# EAGLE design Nixie Clock (EAGLE 7.2.0)

## Sheet 1 of 4
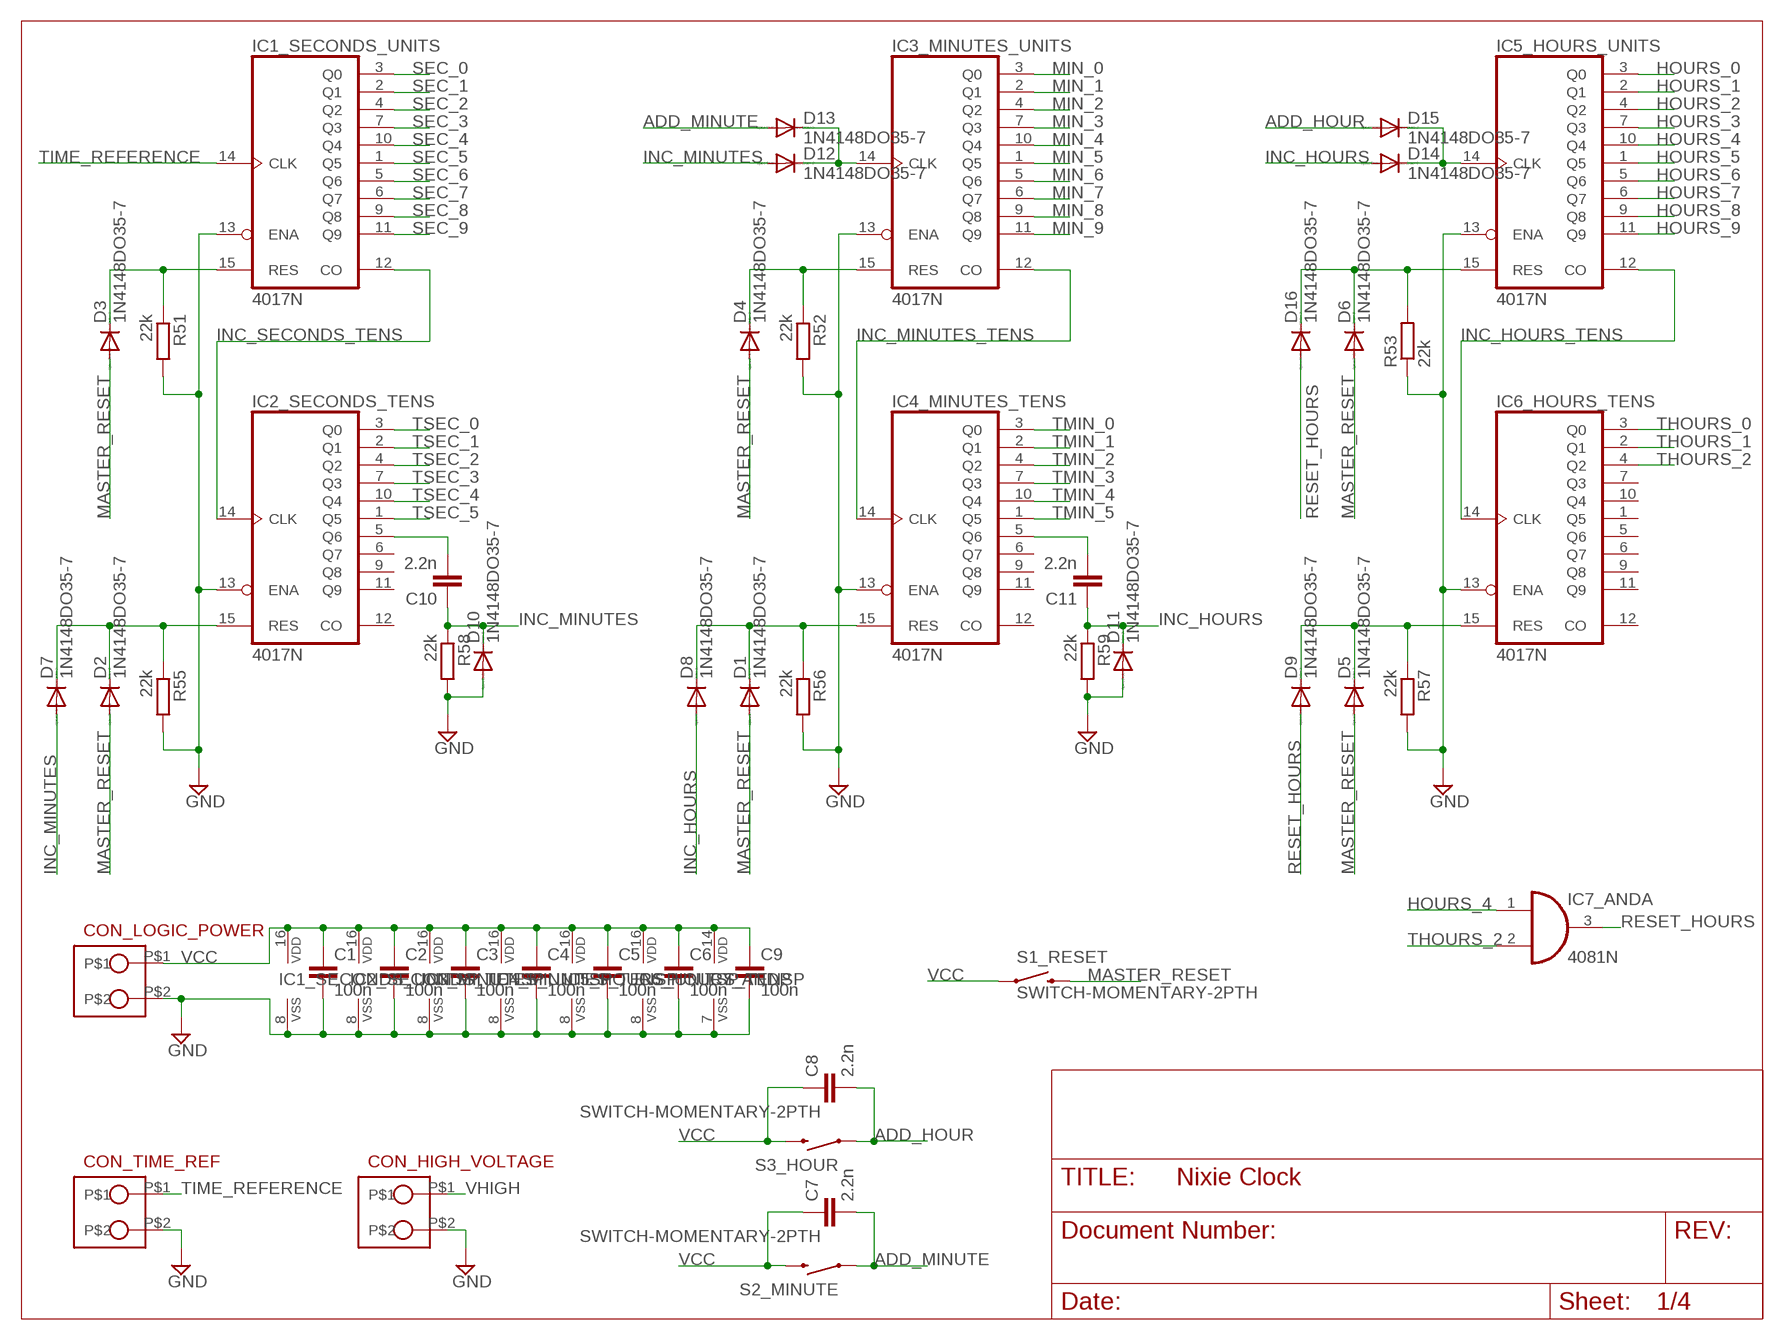
[diagram p0: schematic, sheet 1]

### Parts
C1  100n  C-EU050-030X075  [C050-030X075]
C2  100n  C-EU050-030X075  [C050-030X075]
C3  100n  C-EU050-030X075  [C050-030X075]
C4  100n  C-EU050-030X075  [C050-030X075]
C5  100n  C-EU050-030X075  [C050-030X075]
C6  100n  C-EU050-030X075  [C050-030X075]
C7  2.2n  C-EU050-030X075  [C050-030X075]
C8  2.2n  C-EU050-030X075  [C050-030X075]
C9  100n  C-EU050-030X075  [C050-030X075]
C10  2.2n  C-EU050-030X075  [C050-030X075]
C11  2.2n  C-EU050-030X075  [C050-030X075]
CON_HIGH_VOLTAGE  CON_2_SIL  [SIL_2_0.2INCH]
CON_LOGIC_POWER  CON_2_SIL  [SIL_2_0.2INCH]
CON_TIME_REF  CON_2_SIL  [SIL_2_0.2INCH]
D1  1N4148DO35-7  [DO35-7]
D2  1N4148DO35-7  [DO35-7]
D3  1N4148DO35-7  [DO35-7]
D4  1N4148DO35-7  [DO35-7]
D5  1N4148DO35-7  [DO35-7]
D6  1N4148DO35-7  [DO35-7]
D7  1N4148DO35-7  [DO35-7]
D8  1N4148DO35-7  [DO35-7]
D9  1N4148DO35-7  [DO35-7]
D10  1N4148DO35-7  [DO35-7]
D11  1N4148DO35-7  [DO35-7]
D12  1N4148DO35-7  [DO35-7]
D13  1N4148DO35-7  [DO35-7]
D14  1N4148DO35-7  [DO35-7]
D15  1N4148DO35-7  [DO35-7]
D16  1N4148DO35-7  [DO35-7]
IC1_SECONDS_UNITS  4017N  [DIL16]
IC2_SECONDS_TENS  4017N  [DIL16]
IC3_MINUTES_UNITS  4017N  [DIL16]
IC4_MINUTES_TENS  4017N  [DIL16]
IC5_HOURS_UNITS  4017N  [DIL16]
IC6_HOURS_TENS  4017N  [DIL16]
IC7_AND  4081N  [DIL14]
R51  22k  R-EU_0207/10  [0207/10]
R52  22k  R-EU_0207/10  [0207/10]
R53  22k  R-EU_0207/10  [0207/10]
R55  22k  R-EU_0207/10  [0207/10]
R56  22k  R-EU_0207/10  [0207/10]
R57  22k  R-EU_0207/10  [0207/10]
R58  22k  R-EU_0207/10  [0207/10]
R59  22k  R-EU_0207/10  [0207/10]
S1_RESET  SWITCH-MOMENTARY-2PTH  [TACTILE-PTH]
S2_MINUTE  SWITCH-MOMENTARY-2PTH  [TACTILE-PTH]
S3_HOUR  SWITCH-MOMENTARY-2PTH  [TACTILE-PTH]

### Nets
ADD_HOUR: C8.2 D15.A S3_HOUR.1
ADD_MINUTE: C7.2 D13.A S2_MINUTE.1
GND: C1.2 C2.2 C3.2 C4.2 C5.2 C6.2 C9.2 CON_HIGH_VOLTAGE.P$2 CON_LOGIC_POWER.P$2 CON_TIME_REF.P$2 D10.A D11.A IC1_SECONDS_UNITS.8(VSS) IC1_SECONDS_UNITS.13(ENA) IC2_SECONDS_TENS.8(VSS) IC2_SECONDS_TENS.13(ENA) IC3_MINUTES_UNITS.8(VSS) IC3_MINUTES_UNITS.13(ENA) IC4_MINUTES_TENS.8(VSS) IC4_MINUTES_TENS.13(ENA) IC5_HOURS_UNITS.8(VSS) IC5_HOURS_UNITS.13(ENA) IC6_HOURS_TENS.8(VSS) IC6_HOURS_TENS.13(ENA) IC7_AND.7(P:VSS) R51.2 R52.2 R53.1 R55.2 R56.2 R57.2 R58.2 R59.2 ; also sheet 2,3,4
HOURS_0: IC5_HOURS_UNITS.3(Q0) ; also sheet 4
HOURS_1: IC5_HOURS_UNITS.2(Q1) ; also sheet 4
HOURS_2: IC5_HOURS_UNITS.4(Q2) ; also sheet 4
HOURS_3: IC5_HOURS_UNITS.7(Q3) ; also sheet 4
HOURS_4: IC5_HOURS_UNITS.10(Q4) IC7_AND.1(A:I0) ; also sheet 4
HOURS_5: IC5_HOURS_UNITS.1(Q5) ; also sheet 4
HOURS_6: IC5_HOURS_UNITS.5(Q6) ; also sheet 4
HOURS_7: IC5_HOURS_UNITS.6(Q7) ; also sheet 4
HOURS_8: IC5_HOURS_UNITS.9(Q8) ; also sheet 4
HOURS_9: IC5_HOURS_UNITS.11(Q9) ; also sheet 4
INC_HOURS: C11.1 D8.A D11.C D14.A R59.1
INC_HOURS_TENS: IC5_HOURS_UNITS.12(CO) IC6_HOURS_TENS.14(CLK)
INC_MINUTES: C10.1 D7.A D10.C D12.A R58.1
INC_MINUTES_TENS: IC3_MINUTES_UNITS.12(CO) IC4_MINUTES_TENS.14(CLK)
INC_SECONDS_TENS: IC1_SECONDS_UNITS.12(CO) IC2_SECONDS_TENS.14(CLK)
MASTER_RESET: D1.A D2.A D3.A D4.A D5.A D6.A S1_RESET.3
MIN_0: IC3_MINUTES_UNITS.3(Q0) ; also sheet 3
MIN_1: IC3_MINUTES_UNITS.2(Q1) ; also sheet 3
MIN_2: IC3_MINUTES_UNITS.4(Q2) ; also sheet 3
MIN_3: IC3_MINUTES_UNITS.7(Q3) ; also sheet 3
MIN_4: IC3_MINUTES_UNITS.10(Q4) ; also sheet 3
MIN_5: IC3_MINUTES_UNITS.1(Q5) ; also sheet 3
MIN_6: IC3_MINUTES_UNITS.5(Q6) ; also sheet 3
MIN_7: IC3_MINUTES_UNITS.6(Q7) ; also sheet 3
MIN_8: IC3_MINUTES_UNITS.9(Q8) ; also sheet 3
MIN_9: IC3_MINUTES_UNITS.11(Q9) ; also sheet 3
N$80: D2.C D7.C IC2_SECONDS_TENS.15(RES) R55.1
N$89: D3.C IC1_SECONDS_UNITS.15(RES) R51.1
N$90: C10.2 IC2_SECONDS_TENS.5(Q6)
N$100: D1.C D8.C IC4_MINUTES_TENS.15(RES) R56.1
N$101: C11.2 IC4_MINUTES_TENS.5(Q6)
N$102: D4.C IC3_MINUTES_UNITS.15(RES) R52.1
N$103: D12.C D13.C IC3_MINUTES_UNITS.14(CLK)
N$104: D5.C D9.C IC6_HOURS_TENS.15(RES) R57.1
N$105: D14.C D15.C IC5_HOURS_UNITS.14(CLK)
N$109: D6.C D16.C IC5_HOURS_UNITS.15(RES) R53.2
RESET_HOURS: D9.A D16.A IC7_AND.3(A:O)
SEC_0: IC1_SECONDS_UNITS.3(Q0) ; also sheet 2
SEC_1: IC1_SECONDS_UNITS.2(Q1) ; also sheet 2
SEC_2: IC1_SECONDS_UNITS.4(Q2) ; also sheet 2
SEC_3: IC1_SECONDS_UNITS.7(Q3) ; also sheet 2
SEC_4: IC1_SECONDS_UNITS.10(Q4) ; also sheet 2
SEC_5: IC1_SECONDS_UNITS.1(Q5) ; also sheet 2
SEC_6: IC1_SECONDS_UNITS.5(Q6) ; also sheet 2
SEC_7: IC1_SECONDS_UNITS.6(Q7) ; also sheet 2
SEC_8: IC1_SECONDS_UNITS.9(Q8) ; also sheet 2
SEC_9: IC1_SECONDS_UNITS.11(Q9) ; also sheet 2
THOURS_0: IC6_HOURS_TENS.3(Q0) ; also sheet 4
THOURS_1: IC6_HOURS_TENS.2(Q1) ; also sheet 4
THOURS_2: IC6_HOURS_TENS.4(Q2) IC7_AND.2(A:I1) ; also sheet 4
TIME_REFERENCE: CON_TIME_REF.P$1 IC1_SECONDS_UNITS.14(CLK)
TMIN_0: IC4_MINUTES_TENS.3(Q0) ; also sheet 3
TMIN_1: IC4_MINUTES_TENS.2(Q1) ; also sheet 3
TMIN_2: IC4_MINUTES_TENS.4(Q2) ; also sheet 3
TMIN_3: IC4_MINUTES_TENS.7(Q3) ; also sheet 3
TMIN_4: IC4_MINUTES_TENS.10(Q4) ; also sheet 3
TMIN_5: IC4_MINUTES_TENS.1(Q5) ; also sheet 3
TSEC_0: IC2_SECONDS_TENS.3(Q0) ; also sheet 2
TSEC_1: IC2_SECONDS_TENS.2(Q1) ; also sheet 2
TSEC_2: IC2_SECONDS_TENS.4(Q2) ; also sheet 2
TSEC_3: IC2_SECONDS_TENS.7(Q3) ; also sheet 2
TSEC_4: IC2_SECONDS_TENS.10(Q4) ; also sheet 2
TSEC_5: IC2_SECONDS_TENS.1(Q5) ; also sheet 2
VCC: C1.1 C2.1 C3.1 C4.1 C5.1 C6.1 C7.1 C8.1 C9.1 CON_LOGIC_POWER.P$1 IC1_SECONDS_UNITS.16(VDD) IC2_SECONDS_TENS.16(VDD) IC3_MINUTES_UNITS.16(VDD) IC4_MINUTES_TENS.16(VDD) IC5_HOURS_UNITS.16(VDD) IC6_HOURS_TENS.16(VDD) IC7_AND.14(P:VDD) S1_RESET.1 S2_MINUTE.3 S3_HOUR.3
VHIGH: CON_HIGH_VOLTAGE.P$1 ; also sheet 2,3,4
Unconnected: IC2_SECONDS_TENS.6(Q7) IC2_SECONDS_TENS.9(Q8) IC2_SECONDS_TENS.11(Q9) IC2_SECONDS_TENS.12(CO) IC4_MINUTES_TENS.6(Q7) IC4_MINUTES_TENS.9(Q8) IC4_MINUTES_TENS.11(Q9) IC4_MINUTES_TENS.12(CO) IC6_HOURS_TENS.1(Q5) IC6_HOURS_TENS.5(Q6) IC6_HOURS_TENS.6(Q7) IC6_HOURS_TENS.7(Q3) IC6_HOURS_TENS.9(Q8) IC6_HOURS_TENS.10(Q4) IC6_HOURS_TENS.11(Q9) IC6_HOURS_TENS.12(CO) IC7_AND.4(B:O) IC7_AND.5(B:I0) IC7_AND.6(B:I1) IC7_AND.8(C:I0) IC7_AND.9(C:I1) IC7_AND.10(C:O) IC7_AND.11(D:O) IC7_AND.12(D:I0) IC7_AND.13(D:I1)

## Sheet 2 of 4
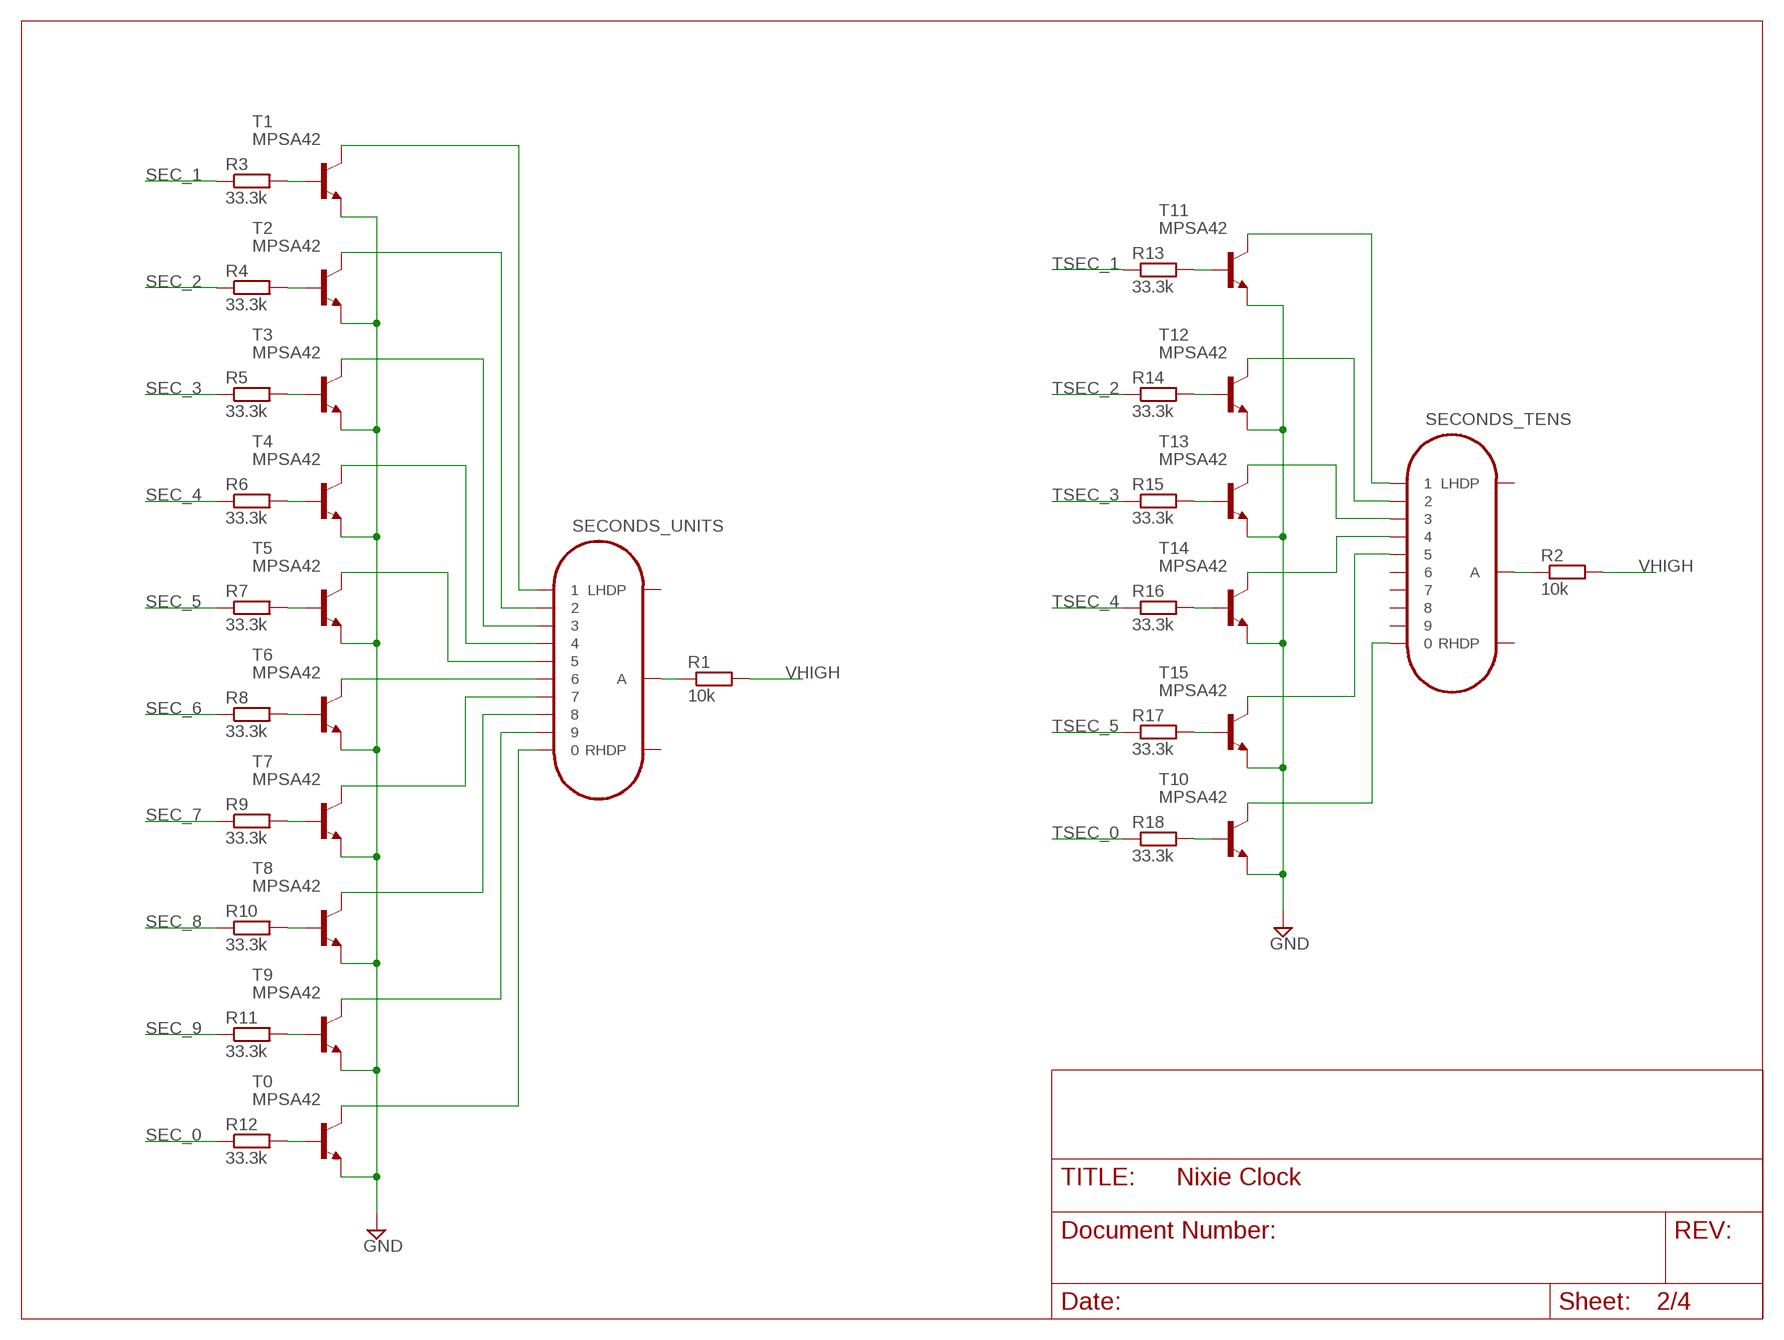
[diagram p1: schematic, sheet 2]

### Parts
R1  10k  R-EU_0207/2V  [0207/2V]
R2  10k  R-EU_0207/2V  [0207/2V]
R3  33.3k  R-EU_0207/10  [0207/10]
R4  33.3k  R-EU_0207/10  [0207/10]
R5  33.3k  R-EU_0207/10  [0207/10]
R6  33.3k  R-EU_0207/10  [0207/10]
R7  33.3k  R-EU_0207/10  [0207/10]
R8  33.3k  R-EU_0207/10  [0207/10]
R9  33.3k  R-EU_0207/10  [0207/10]
R10  33.3k  R-EU_0207/10  [0207/10]
R11  33.3k  R-EU_0207/10  [0207/10]
R12  33.3k  R-EU_0207/10  [0207/10]
R13  33.3k  R-EU_0207/10  [0207/10]
R14  33.3k  R-EU_0207/10  [0207/10]
R15  33.3k  R-EU_0207/10  [0207/10]
R16  33.3k  R-EU_0207/10  [0207/10]
R17  33.3k  R-EU_0207/10  [0207/10]
R18  33.3k  R-EU_0207/10  [0207/10]
SECONDS_TENS  IN-14BIG_PADS  [IN-14-BIG-PADS]
SECONDS_UNITS  IN-14BIG_PADS  [IN-14-BIG-PADS]
T0  MPSA42  [TO92]
T1  MPSA42  [TO92]
T2  MPSA42  [TO92]
T3  MPSA42  [TO92]
T4  MPSA42  [TO92]
T5  MPSA42  [TO92]
T6  MPSA42  [TO92]
T7  MPSA42  [TO92]
T8  MPSA42  [TO92]
T9  MPSA42  [TO92]
T10  MPSA42  [TO92]
T11  MPSA42  [TO92]
T12  MPSA42  [TO92]
T13  MPSA42  [TO92]
T14  MPSA42  [TO92]
T15  MPSA42  [TO92]

### Nets
GND: T0.1(E) T1.1(E) T2.1(E) T3.1(E) T4.1(E) T5.1(E) T6.1(E) T7.1(E) T8.1(E) T9.1(E) T10.1(E) T11.1(E) T12.1(E) T13.1(E) T14.1(E) T15.1(E) ; also sheet 1,3,4
N$1: R6.2 T4.2(B)
N$2: R7.2 T5.2(B)
N$3: R8.2 T6.2(B)
N$4: R9.2 T7.2(B)
N$5: R10.2 T8.2(B)
N$6: R11.2 T9.2(B)
N$7: R12.2 T0.2(B)
N$8: R1.1 SECONDS_UNITS.A
N$9: R2.1 SECONDS_TENS.A
N$10: R13.2 T11.2(B)
N$11: R14.2 T12.2(B)
N$12: R15.2 T13.2(B)
N$13: R16.2 T14.2(B)
N$14: R17.2 T15.2(B)
N$15: R18.2 T10.2(B)
N$16: R3.2 T1.2(B)
N$17: R4.2 T2.2(B)
N$18: R5.2 T3.2(B)
N$19: SECONDS_TENS.1 T11.3(C)
N$20: SECONDS_TENS.2 T12.3(C)
N$21: SECONDS_TENS.3 T13.3(C)
N$22: SECONDS_TENS.4 T14.3(C)
N$23: SECONDS_TENS.5 T15.3(C)
N$24: SECONDS_TENS.0 T10.3(C)
N$26: SECONDS_UNITS.1 T1.3(C)
N$27: SECONDS_UNITS.2 T2.3(C)
N$28: SECONDS_UNITS.3 T3.3(C)
N$29: SECONDS_UNITS.4 T4.3(C)
N$30: SECONDS_UNITS.5 T5.3(C)
N$31: SECONDS_UNITS.6 T6.3(C)
N$32: SECONDS_UNITS.0 T0.3(C)
N$33: SECONDS_UNITS.9 T9.3(C)
N$34: SECONDS_UNITS.8 T8.3(C)
N$79: SECONDS_UNITS.7 T7.3(C)
SEC_0: R12.1 ; also sheet 1
SEC_1: R3.1 ; also sheet 1
SEC_2: R4.1 ; also sheet 1
SEC_3: R5.1 ; also sheet 1
SEC_4: R6.1 ; also sheet 1
SEC_5: R7.1 ; also sheet 1
SEC_6: R8.1 ; also sheet 1
SEC_7: R9.1 ; also sheet 1
SEC_8: R10.1 ; also sheet 1
SEC_9: R11.1 ; also sheet 1
TSEC_0: R18.1 ; also sheet 1
TSEC_1: R13.1 ; also sheet 1
TSEC_2: R14.1 ; also sheet 1
TSEC_3: R15.1 ; also sheet 1
TSEC_4: R16.1 ; also sheet 1
TSEC_5: R17.1 ; also sheet 1
VHIGH: R1.2 R2.2 ; also sheet 1,3,4
Unconnected: SECONDS_TENS.6 SECONDS_TENS.7 SECONDS_TENS.8 SECONDS_TENS.9 SECONDS_TENS.LHDP SECONDS_TENS.RHDP SECONDS_UNITS.LHDP SECONDS_UNITS.RHDP

## Sheet 3 of 4
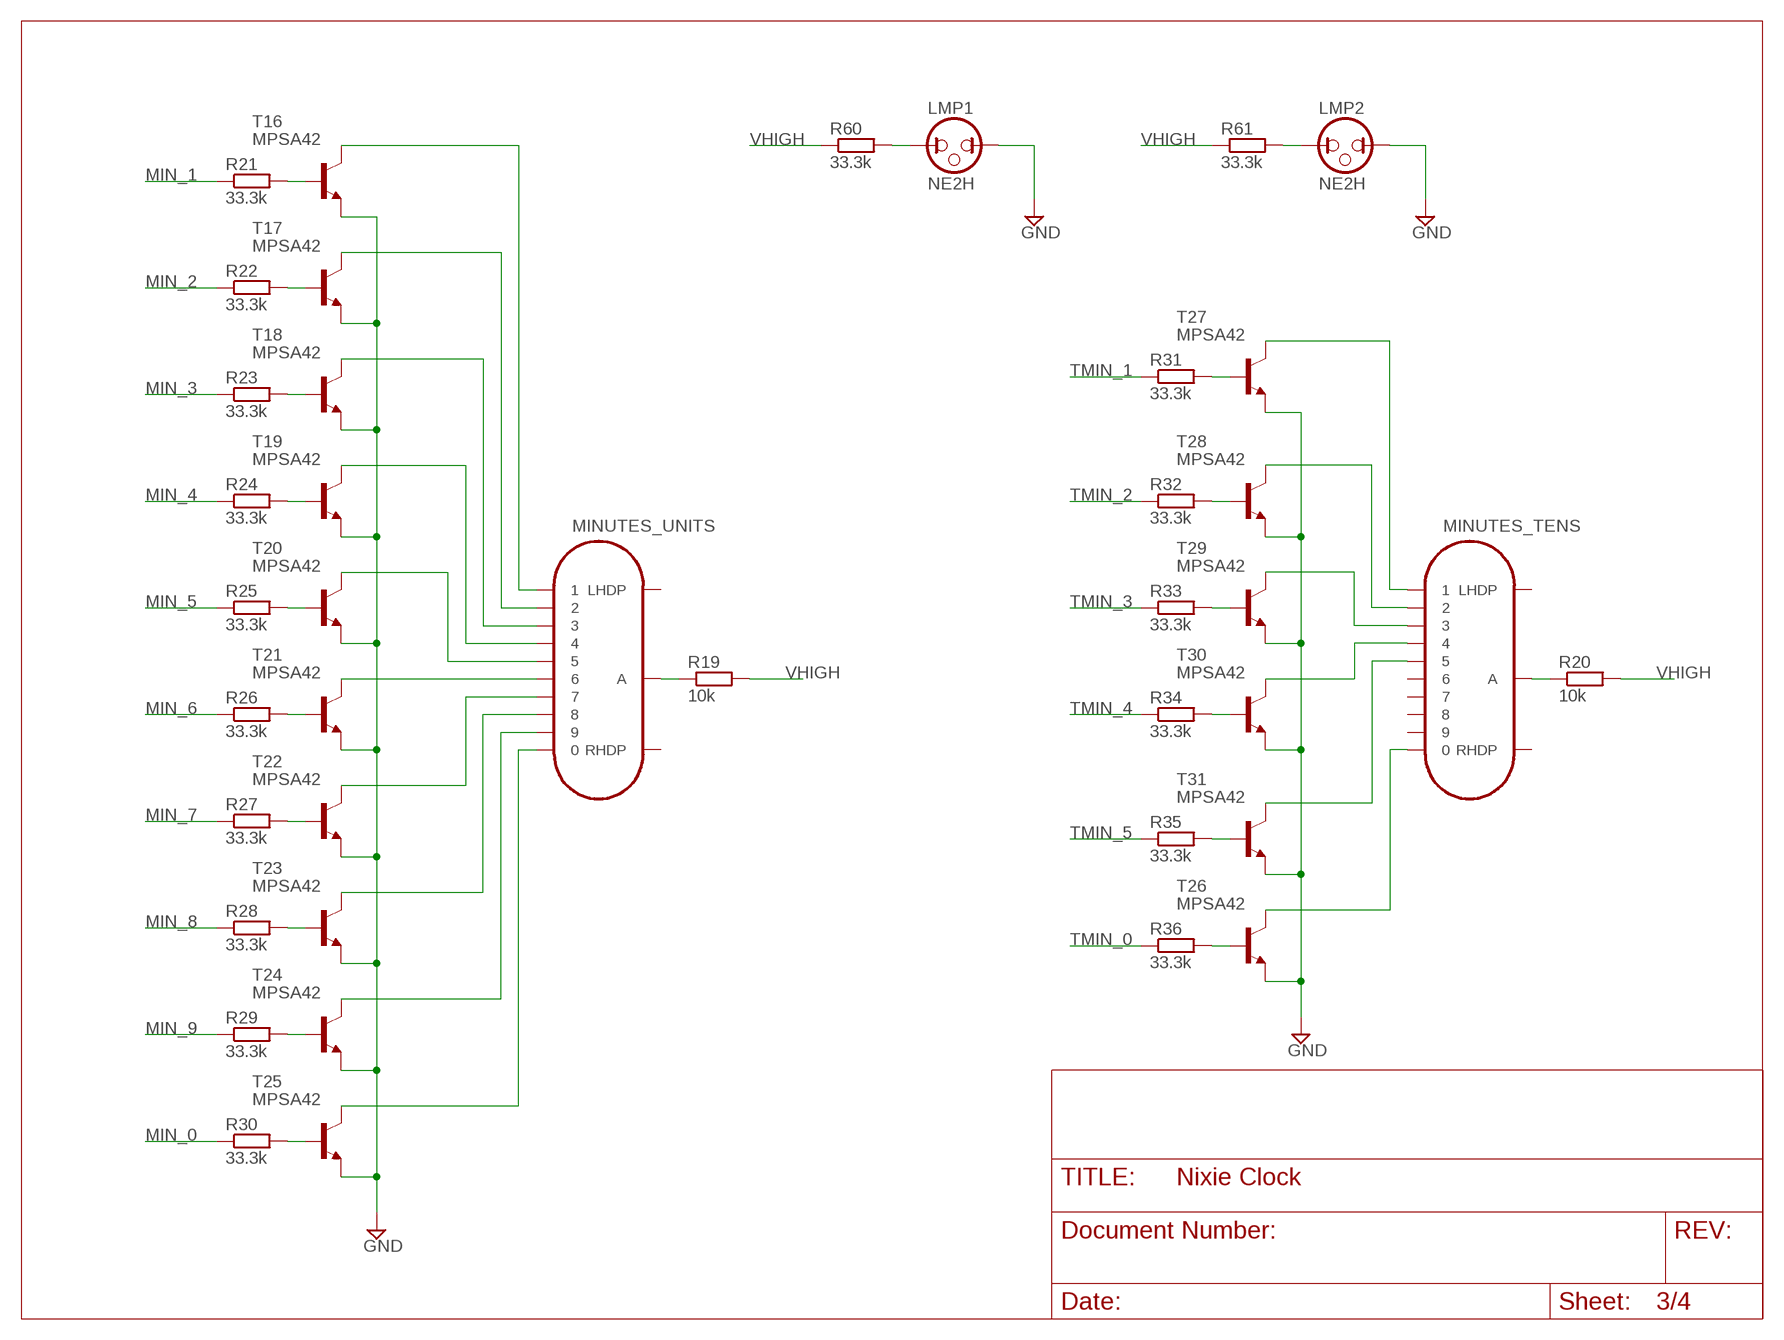
[diagram p2: schematic, sheet 3]

### Parts
LMP1  NE2H  NEON_LAMP  [NEON_LAMP_0.1_INCH]
LMP2  NE2H  NEON_LAMP  [NEON_LAMP_0.1_INCH]
MINUTES_TENS  IN-14BIG_PADS  [IN-14-BIG-PADS]
MINUTES_UNITS  IN-14BIG_PADS  [IN-14-BIG-PADS]
R19  10k  R-EU_0207/2V  [0207/2V]
R20  10k  R-EU_0207/2V  [0207/2V]
R21  33.3k  R-EU_0207/10  [0207/10]
R22  33.3k  R-EU_0207/10  [0207/10]
R23  33.3k  R-EU_0207/10  [0207/10]
R24  33.3k  R-EU_0207/10  [0207/10]
R25  33.3k  R-EU_0207/10  [0207/10]
R26  33.3k  R-EU_0207/10  [0207/10]
R27  33.3k  R-EU_0207/10  [0207/10]
R28  33.3k  R-EU_0207/10  [0207/10]
R29  33.3k  R-EU_0207/10  [0207/10]
R30  33.3k  R-EU_0207/10  [0207/10]
R31  33.3k  R-EU_0207/10  [0207/10]
R32  33.3k  R-EU_0207/10  [0207/10]
R33  33.3k  R-EU_0207/10  [0207/10]
R34  33.3k  R-EU_0207/10  [0207/10]
R35  33.3k  R-EU_0207/10  [0207/10]
R36  33.3k  R-EU_0207/10  [0207/10]
R60  33.3k  R-EU_0207/2V  [0207/2V]
R61  33.3k  R-EU_0207/2V  [0207/2V]
T16  MPSA42  [TO92]
T17  MPSA42  [TO92]
T18  MPSA42  [TO92]
T19  MPSA42  [TO92]
T20  MPSA42  [TO92]
T21  MPSA42  [TO92]
T22  MPSA42  [TO92]
T23  MPSA42  [TO92]
T24  MPSA42  [TO92]
T25  MPSA42  [TO92]
T26  MPSA42  [TO92]
T27  MPSA42  [TO92]
T28  MPSA42  [TO92]
T29  MPSA42  [TO92]
T30  MPSA42  [TO92]
T31  MPSA42  [TO92]

### Nets
GND: LMP1.P$2 LMP2.P$2 T16.1(E) T17.1(E) T18.1(E) T19.1(E) T20.1(E) T21.1(E) T22.1(E) T23.1(E) T24.1(E) T25.1(E) T26.1(E) T27.1(E) T28.1(E) T29.1(E) T30.1(E) T31.1(E) ; also sheet 1,2,4
MIN_0: R30.1 ; also sheet 1
MIN_1: R21.1 ; also sheet 1
MIN_2: R22.1 ; also sheet 1
MIN_3: R23.1 ; also sheet 1
MIN_4: R24.1 ; also sheet 1
MIN_5: R25.1 ; also sheet 1
MIN_6: R26.1 ; also sheet 1
MIN_7: R27.1 ; also sheet 1
MIN_8: R28.1 ; also sheet 1
MIN_9: R29.1 ; also sheet 1
N$35: R24.2 T19.2(B)
N$36: R25.2 T20.2(B)
N$37: R26.2 T21.2(B)
N$38: R27.2 T22.2(B)
N$39: R28.2 T23.2(B)
N$40: R29.2 T24.2(B)
N$41: R30.2 T25.2(B)
N$42: MINUTES_UNITS.A R19.1
N$43: MINUTES_TENS.A R20.1
N$44: R31.2 T27.2(B)
N$45: R32.2 T28.2(B)
N$46: R33.2 T29.2(B)
N$47: R34.2 T30.2(B)
N$48: R35.2 T31.2(B)
N$49: R36.2 T26.2(B)
N$50: R21.2 T16.2(B)
N$51: R22.2 T17.2(B)
N$52: R23.2 T18.2(B)
N$53: MINUTES_TENS.1 T27.3(C)
N$54: MINUTES_TENS.2 T28.3(C)
N$55: MINUTES_TENS.3 T29.3(C)
N$56: MINUTES_TENS.4 T30.3(C)
N$57: MINUTES_TENS.5 T31.3(C)
N$58: MINUTES_TENS.0 T26.3(C)
N$59: MINUTES_UNITS.1 T16.3(C)
N$60: MINUTES_UNITS.2 T17.3(C)
N$61: MINUTES_UNITS.3 T18.3(C)
N$62: MINUTES_UNITS.4 T19.3(C)
N$63: MINUTES_UNITS.5 T20.3(C)
N$64: MINUTES_UNITS.6 T21.3(C)
N$65: MINUTES_UNITS.0 T25.3(C)
N$66: MINUTES_UNITS.9 T24.3(C)
N$67: MINUTES_UNITS.8 T23.3(C)
N$87: MINUTES_UNITS.7 T22.3(C)
N$107: LMP2.P$1 R61.2
N$108: LMP1.P$1 R60.2
TMIN_0: R36.1 ; also sheet 1
TMIN_1: R31.1 ; also sheet 1
TMIN_2: R32.1 ; also sheet 1
TMIN_3: R33.1 ; also sheet 1
TMIN_4: R34.1 ; also sheet 1
TMIN_5: R35.1 ; also sheet 1
VHIGH: R19.2 R20.2 R60.1 R61.1 ; also sheet 1,2,4
Unconnected: MINUTES_TENS.6 MINUTES_TENS.7 MINUTES_TENS.8 MINUTES_TENS.9 MINUTES_TENS.LHDP MINUTES_TENS.RHDP MINUTES_UNITS.LHDP MINUTES_UNITS.RHDP

## Sheet 4 of 4
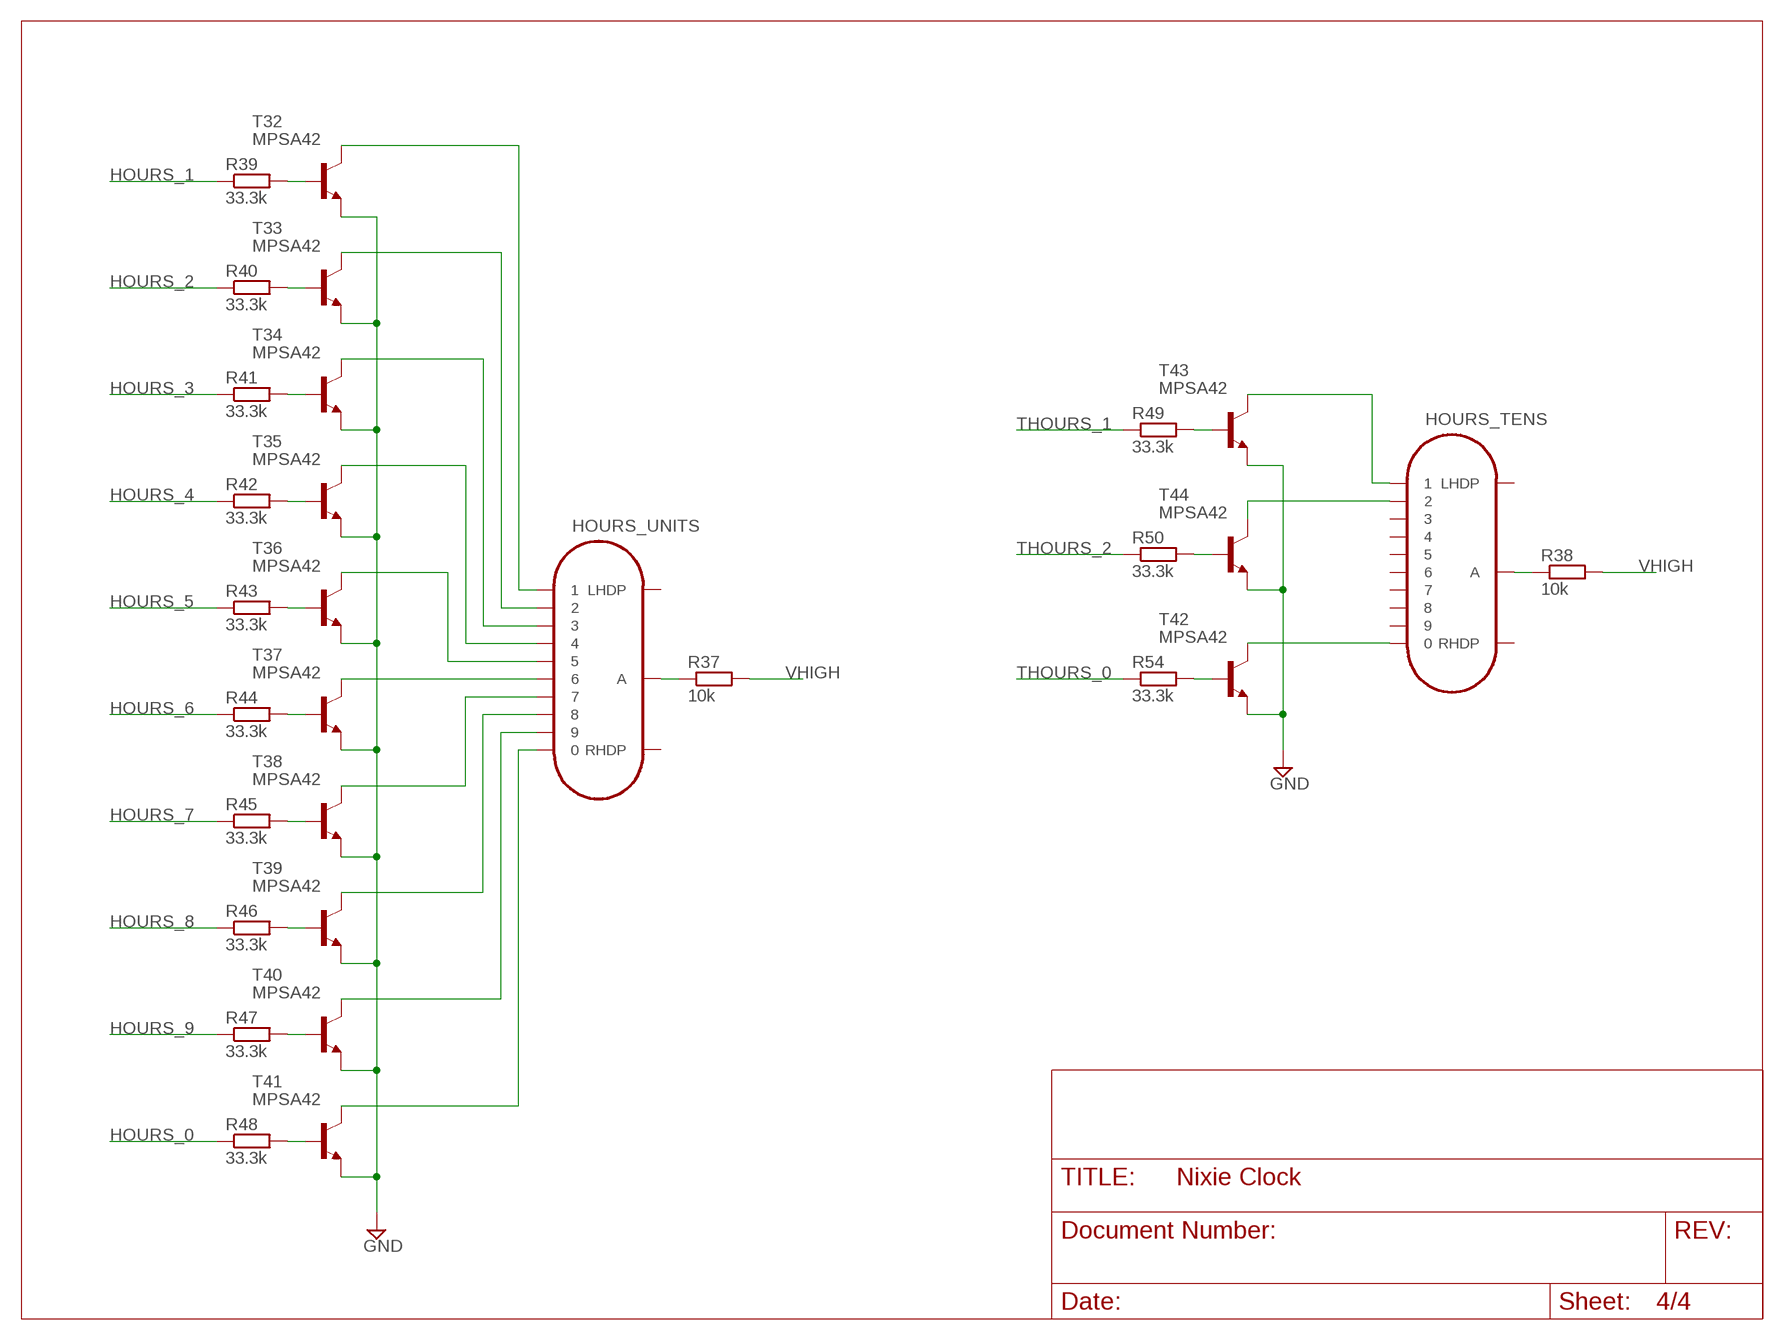
[diagram p3: schematic, sheet 4]

### Parts
HOURS_TENS  IN-14BIG_PADS  [IN-14-BIG-PADS]
HOURS_UNITS  IN-14BIG_PADS  [IN-14-BIG-PADS]
R37  10k  R-EU_0207/2V  [0207/2V]
R38  10k  R-EU_0207/2V  [0207/2V]
R39  33.3k  R-EU_0207/10  [0207/10]
R40  33.3k  R-EU_0207/10  [0207/10]
R41  33.3k  R-EU_0207/10  [0207/10]
R42  33.3k  R-EU_0207/10  [0207/10]
R43  33.3k  R-EU_0207/10  [0207/10]
R44  33.3k  R-EU_0207/10  [0207/10]
R45  33.3k  R-EU_0207/10  [0207/10]
R46  33.3k  R-EU_0207/10  [0207/10]
R47  33.3k  R-EU_0207/10  [0207/10]
R48  33.3k  R-EU_0207/10  [0207/10]
R49  33.3k  R-EU_0207/10  [0207/10]
R50  33.3k  R-EU_0207/10  [0207/10]
R54  33.3k  R-EU_0207/10  [0207/10]
T32  MPSA42  [TO92]
T33  MPSA42  [TO92]
T34  MPSA42  [TO92]
T35  MPSA42  [TO92]
T36  MPSA42  [TO92]
T37  MPSA42  [TO92]
T38  MPSA42  [TO92]
T39  MPSA42  [TO92]
T40  MPSA42  [TO92]
T41  MPSA42  [TO92]
T42  MPSA42  [TO92]
T43  MPSA42  [TO92]
T44  MPSA42  [TO92]

### Nets
GND: T32.1(E) T33.1(E) T34.1(E) T35.1(E) T36.1(E) T37.1(E) T38.1(E) T39.1(E) T40.1(E) T41.1(E) T42.1(E) T43.1(E) T44.1(E) ; also sheet 1,2,3
HOURS_0: R48.1 ; also sheet 1
HOURS_1: R39.1 ; also sheet 1
HOURS_2: R40.1 ; also sheet 1
HOURS_3: R41.1 ; also sheet 1
HOURS_4: R42.1 ; also sheet 1
HOURS_5: R43.1 ; also sheet 1
HOURS_6: R44.1 ; also sheet 1
HOURS_7: R45.1 ; also sheet 1
HOURS_8: R46.1 ; also sheet 1
HOURS_9: R47.1 ; also sheet 1
N$25: R42.2 T35.2(B)
N$68: R43.2 T36.2(B)
N$69: R44.2 T37.2(B)
N$70: R45.2 T38.2(B)
N$71: R46.2 T39.2(B)
N$72: R47.2 T40.2(B)
N$73: R48.2 T41.2(B)
N$74: HOURS_UNITS.A R37.1
N$75: HOURS_TENS.A R38.1
N$76: R49.2 T43.2(B)
N$77: R50.2 T44.2(B)
N$78: HOURS_TENS.0 T42.3(C)
N$81: R54.2 T42.2(B)
N$82: R39.2 T32.2(B)
N$83: R40.2 T33.2(B)
N$84: R41.2 T34.2(B)
N$85: HOURS_TENS.1 T43.3(C)
N$86: HOURS_TENS.2 T44.3(C)
N$88: HOURS_UNITS.7 T38.3(C)
N$91: HOURS_UNITS.1 T32.3(C)
N$92: HOURS_UNITS.2 T33.3(C)
N$93: HOURS_UNITS.3 T34.3(C)
N$94: HOURS_UNITS.4 T35.3(C)
N$95: HOURS_UNITS.5 T36.3(C)
N$96: HOURS_UNITS.6 T37.3(C)
N$97: HOURS_UNITS.0 T41.3(C)
N$98: HOURS_UNITS.9 T40.3(C)
N$99: HOURS_UNITS.8 T39.3(C)
THOURS_0: R54.1 ; also sheet 1
THOURS_1: R49.1 ; also sheet 1
THOURS_2: R50.1 ; also sheet 1
VHIGH: R37.2 R38.2 ; also sheet 1,2,3
Unconnected: HOURS_TENS.3 HOURS_TENS.4 HOURS_TENS.5 HOURS_TENS.6 HOURS_TENS.7 HOURS_TENS.8 HOURS_TENS.9 HOURS_TENS.LHDP HOURS_TENS.RHDP HOURS_UNITS.LHDP HOURS_UNITS.RHDP

## Library data of the parts
C1-C11 = resistor:C-EU: CAPACITOR, European symbol
CON_HIGH_VOLTAGE CON_LOGIC_POWER CON_TIME_REF = PGT:CON_2_SIL: Connecteur à 2 pattes, avec un écart de 0.2 inc (soit 5.08 mm).
D1-D16 = diode:1N4148: DIODE high speed (Philips)
HOURS_TENS HOURS_UNITS MINUTES_TENS MINUTES_UNITS SECONDS_TENS SECONDS_UNITS = PGT:IN-14: IN-14: medium numeric frontview nixie tube
IC1_SECONDS_UNITS IC2_SECONDS_TENS IC3_MINUTES_UNITS IC4_MINUTES_TENS IC5_HOURS_UNITS IC6_HOURS_TENS = 40xx:4017: COUNTER/DIVIDER
IC7_AND = 40xx:4081: Quad 2-input AND
LMP1 LMP2 = PGT:NEON_LAMP: Neon lamp.
R1-R61 = resistor:R-EU_: RESISTOR, European symbol
S1_RESET S2_MINUTE S3_HOUR = SparkFun-Electromechanical:SWITCH-MOMENTARY-2: Various NO switches- pushbuttons, reed, etc; PROD_ID: SWCH-08441
T0 T1-T44 = PGT:MPSA42: NPN TRANSISTOR

## Board
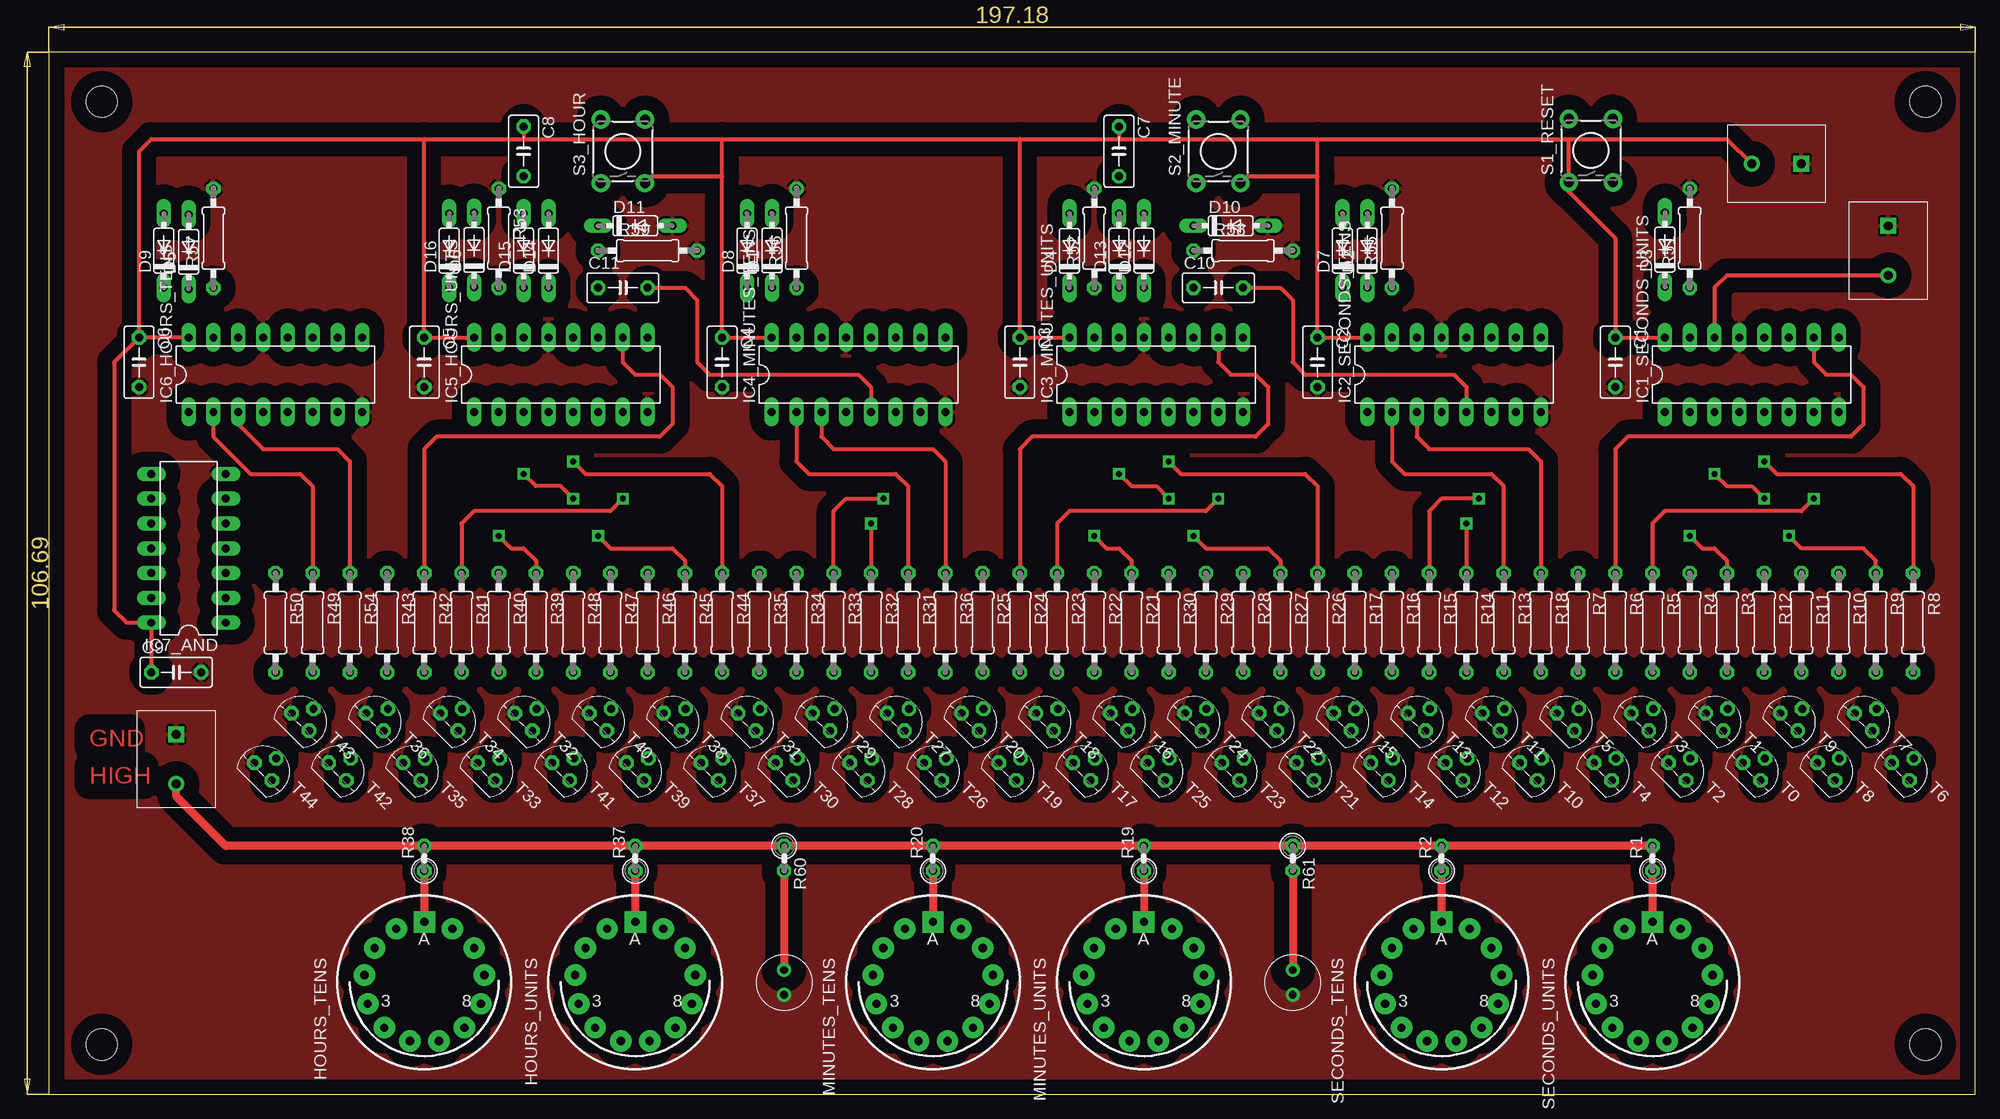
[diagram p4: board, top side]
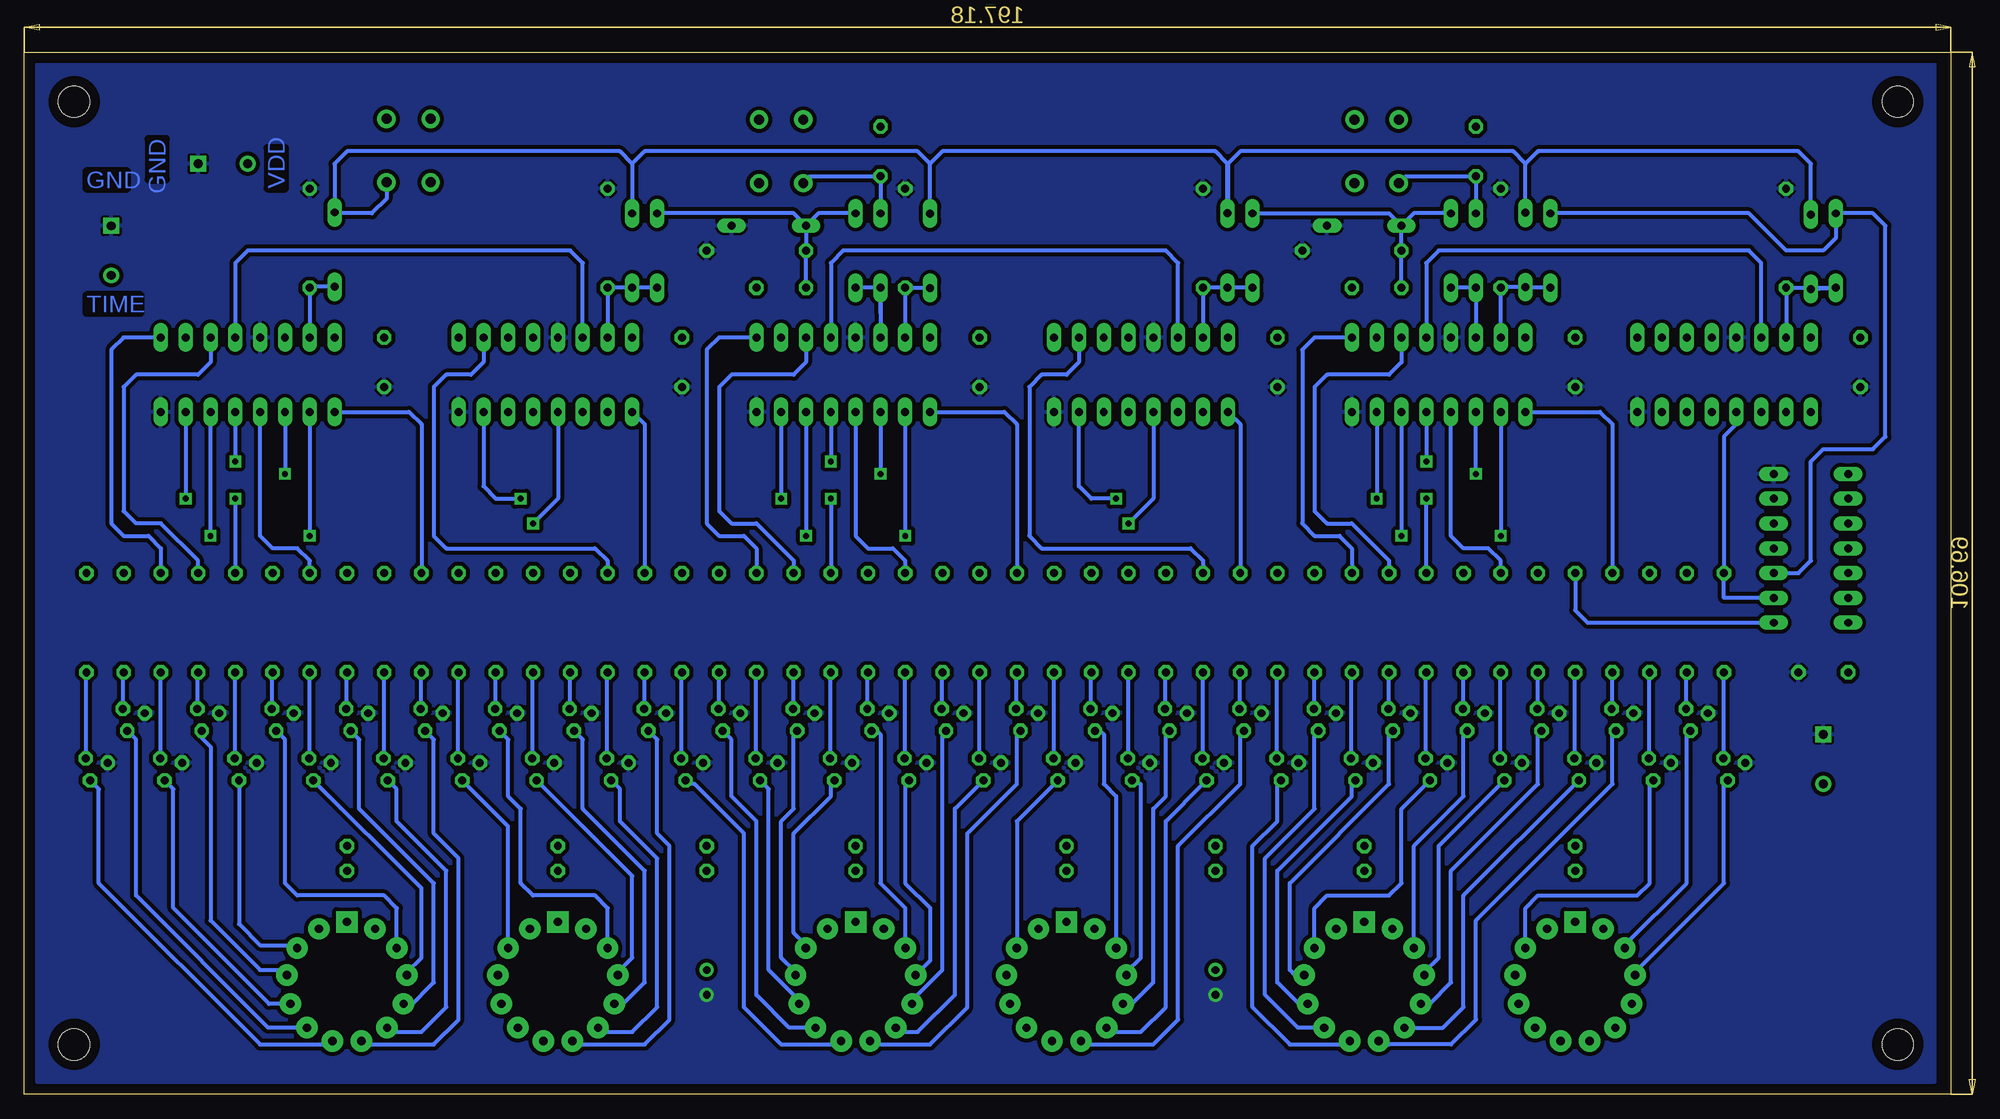
[diagram p5: board, bottom side, seen from below]

Size 197.18 x 106.69 mm. Coordinates in mm from the lower left corner, seen from the top.
Outline: 197.18,106.69 0,106.69 0,0 197.18,0 197.18,106.69
Copper layers (1*16): Top 0.035mm / dielectric 1.5mm / Bottom 0.035mm
Design rules "default *": minimum track width 10mil, minimum drill 24mil, track to track 8mil, track to pad 8mil, pad to pad 8mil, via to via 8mil, smd to smd 8mil, copper to edge 40mil, drill to drill 8mil, minimum pad ring 10mil, minimum via ring 8mil, stop-mask expansion 4mil, vias tented up to drill 0mil, thermal gap 10mil
Holes 3.2 mm at 5.41,101.61 192.1,101.61 192.1,5.09 5.41,5.09

### Footprints (pad centres in the part's own frame; a part is rotated, then mirrored left to right if it is on the bottom)
C050-030X075 = drill 0.813 octagon: 1 -2.54,0; 2 2.54,0
SIL_2_0.2INCH = drill 0.9: P$1 0,2.54 | drill 0.9 square: P$2 0,-2.54
DO35-7 = drill 0.813 long: A 3.81,0; C -3.81,0
IN-14-BIG-PADS = drill 0.84 pad 2.184: 0 5.094,3.516; 1 -5.094,3.516; 2 -6.145,0.746; 3 -5.788,-2.195; 4 -4.105,-4.633; 5 -1.481,-6.01; 6 1.481,-6.01; 7 4.105,-4.633; 8 5.788,-2.195; 9 6.145,0.746; LHDP -2.877,5.481; RHDP 2.877,5.481 | drill 0.84 pad 2.184 square: A 0,6.19
DIL16 = drill 0.813 long: 1 -8.89,-3.81; 2 -6.35,-3.81; 3 -3.81,-3.81; 4 -1.27,-3.81; 5 1.27,-3.81; 6 3.81,-3.81; 7 6.35,-3.81; 8 8.89,-3.81; 9 8.89,3.81; 10 6.35,3.81; 11 3.81,3.81; 12 1.27,3.81; 13 -1.27,3.81; 14 -3.81,3.81; 15 -6.35,3.81; 16 -8.89,3.81
DIL14 = drill 0.813 long: 1 -7.62,-3.81; 2 -5.08,-3.81; 3 -2.54,-3.81; 4 0,-3.81; 5 2.54,-3.81; 6 5.08,-3.81; 7 7.62,-3.81; 8 7.62,3.81; 9 5.08,3.81; 10 2.54,3.81; 11 0,3.81; 12 -2.54,3.81; 13 -5.08,3.81; 14 -7.62,3.81
NEON_LAMP_0.1_INCH = drill 0.8: P$1 -1.27,0; P$2 1.27,0
0207/2V = drill 0.813 octagon: 1 -1.27,0; 2 1.27,0
0207/10 = drill 0.813 octagon: 1 -5.08,0; 2 5.08,0
TACTILE-PTH = drill 1.016 pad 1.88: 1 -3.251,2.261; 2 3.251,2.261; 3 -3.251,-2.261; 4 3.251,-2.261
TO92 = drill 0.813 octagon: 1 -1.27,0; 2 0,1.905; 3 1.27,0

### Placement (x,y rotation side)
C1  160.35,74.94 270 top
C2  129.87,74.94 270 top
C3  99.39,74.94 270 top
C4  68.91,74.94 270 top
C5  38.43,74.94 270 top
C6  9.22,74.94 270 top
C7  109.55,96.53 270 top
C8  48.59,96.53 270 top
C9  13.03,43.19 0 top
C10  119.71,82.56 0 top
C11  58.75,82.56 0 top
CON_HIGH_VOLTAGE  13.03,34.3 180 top
CON_LOGIC_POWER  176.86,95.26 90 top
CON_TIME_REF  188.29,86.37 180 top
D1  74.02,86.38 90 top
D2  134.95,86.37 90 top
D3  165.43,86.47 90 top
D4  104.46,86.36 90 top
D5  14.3,86.26 90 top
D6  43.51,86.43 90 top
D7  132.41,86.37 90 top
D8  71.45,86.37 90 top
D9  11.76,86.37 90 top
D10  120.98,88.91 0 top
D11  60.02,88.91 0 top
D12  112.09,86.37 90 top
D13  109.55,86.37 90 top
D14  51.13,86.37 90 top
D15  48.59,86.37 90 top
D16  40.97,86.37 90 top
HOURS_TENS  38.43,11.44 0 top
HOURS_UNITS  60.02,11.44 0 top
IC1_SECONDS_UNITS  174.32,73.67 0 top
IC2_SECONDS_TENS  143.84,73.67 0 top
IC3_MINUTES_UNITS  113.36,73.67 0 top
IC4_MINUTES_TENS  82.88,73.67 0 top
IC5_HOURS_UNITS  52.4,73.67 0 top
IC6_HOURS_TENS  23.19,73.67 0 top
IC7_AND  14.3,55.89 90 top
LMP1  75.26,11.44 270 top
LMP2  127.33,11.44 270 top
MINUTES_TENS  90.5,11.44 0 top
MINUTES_UNITS  112.09,11.44 0 top
R1  164.16,24.14 90 top
R2  142.57,24.14 90 top
R3  171.78,48.27 270 top
R4  167.97,48.27 270 top
R5  164.16,48.27 270 top
R6  160.35,48.27 270 top
R7  156.54,48.27 270 top
R8  190.83,48.27 270 top
R9  187.02,48.27 270 top
R10  183.21,48.27 270 top
R11  179.4,48.27 270 top
R12  175.59,48.27 270 top
R13  148.92,48.27 270 top
R14  145.11,48.27 270 top
R15  141.3,48.27 270 top
R16  137.49,48.27 270 top
R17  133.68,48.27 270 top
R18  152.73,48.27 270 top
R19  112.09,24.14 90 top
R20  90.5,24.14 90 top
R21  110.82,48.27 270 top
R22  107.01,48.27 270 top
R23  103.2,48.27 270 top
R24  99.39,48.27 270 top
R25  95.58,48.27 270 top
R26  129.87,48.27 270 top
R27  126.06,48.27 270 top
R28  122.25,48.27 270 top
R29  118.44,48.27 270 top
R30  114.63,48.27 270 top
R31  87.96,48.27 270 top
R32  84.15,48.27 270 top
R33  80.34,48.27 270 top
R34  76.53,48.27 270 top
R35  72.72,48.27 270 top
R36  91.77,48.27 270 top
R37  60.02,24.14 90 top
R38  38.43,24.14 90 top
R39  49.86,48.27 270 top
R40  46.05,48.27 270 top
R41  42.24,48.27 270 top
R42  38.43,48.27 270 top
R43  34.62,48.27 270 top
R44  68.91,48.27 270 top
R45  65.1,48.27 270 top
R46  61.29,48.27 270 top
R47  57.48,48.27 270 top
R48  53.67,48.27 270 top
R49  27,48.27 270 top
R50  23.19,48.27 270 top
R51  167.97,87.64 90 top
R52  107.01,87.64 90 top
R53  46.05,87.64 270 top
R54  30.81,48.27 270 top
R55  137.49,87.64 90 top
R56  76.53,87.64 90 top
R57  16.84,87.64 90 top
R58  122.25,86.37 0 top
R59  61.29,86.37 0 top
R60  75.26,24.14 270 top
R61  127.33,24.14 270 top
S1_RESET  157.85,96.61 90 top
S2_MINUTE  119.71,96.53 90 top
S3_HOUR  58.75,96.53 90 top
SECONDS_TENS  142.57,11.44 0 top
SECONDS_UNITS  164.16,11.44 0 top
T0  174.32,33.03 315 top
T1  170.51,38.11 315 top
T2  166.7,33.03 315 top
T3  162.89,38.11 315 top
T4  159.08,33.03 315 top
T5  155.27,38.11 315 top
T6  189.56,33.03 315 top
T7  185.75,38.11 315 top
T8  181.94,33.03 315 top
T9  178.13,38.11 315 top
T10  151.46,33.03 315 top
T11  147.65,38.11 315 top
T12  143.84,33.03 315 top
T13  140.03,38.11 315 top
T14  136.22,33.03 315 top
T15  132.41,38.11 315 top
T16  109.55,38.11 315 top
T17  105.74,33.03 315 top
T18  101.93,38.11 315 top
T19  98.12,33.03 315 top
T20  94.31,38.11 315 top
T21  128.6,33.03 315 top
T22  124.79,38.11 315 top
T23  120.98,33.03 315 top
T24  117.17,38.11 315 top
T25  113.36,33.03 315 top
T26  90.5,33.03 315 top
T27  86.69,38.11 315 top
T28  82.88,33.03 315 top
T29  79.07,38.11 315 top
T30  75.26,33.03 315 top
T31  71.45,38.11 315 top
T32  48.59,38.11 315 top
T33  44.78,33.03 315 top
T34  40.97,38.11 315 top
T35  37.16,33.03 315 top
T36  33.35,38.11 315 top
T37  67.64,33.03 315 top
T38  63.83,38.11 315 top
T39  60.02,33.03 315 top
T40  56.21,38.11 315 top
T41  52.4,33.03 315 top
T42  29.54,33.03 315 top
T43  25.73,38.11 315 top
T44  21.92,33.03 315 top

### Tracks (layer width: path | path; a pad name or v marks a point on that pad's centre or on a via)
ADD_HOUR
  Bottom 0.406: S3_HOUR.1 55.78,93.99 C8.2 D15.A
ADD_MINUTE
  Bottom 0.406: D13.A C7.2 116.74,93.99 S2_MINUTE.1
GND
  pour Bottom (isolate 0.406): 1.6,1.28 1.6,105.42 195.91,105.42 195.91,1.28
  pour Top (isolate 1.524): 1.6,105.42 195.91,105.42 195.91,1.28 1.6,1.28
HOURS_0  (via drill 0.6)
  Top 0.406: v53.67,60.97 52.4,62.24 49.86,62.24 v48.59,63.51
  Bottom 0.406: R48.1 v53.67,60.97 | v48.59,63.51 IC5_HOURS_UNITS.3
HOURS_1  (via drill 0.6)
  Top 0.406: v46.05,57.16 47.32,55.89 48.59,55.89 49.86,54.62 R39.1
  Bottom 0.406: IC5_HOURS_UNITS.2 v46.05,57.16
HOURS_2
  Bottom 0.406: R40.1 46.05,54.62 47.32,55.89 49.86,55.89 51.13,57.16 IC5_HOURS_UNITS.4
HOURS_3  (via drill 0.6)
  Top 0.406: v58.75,60.97 57.48,59.7 43.51,59.7 42.24,58.43 R41.1
  Bottom 0.406: IC5_HOURS_UNITS.7 v58.75,60.97
HOURS_4
  Top 0.406: IC5_HOURS_UNITS.10 58.75,74.94 60.02,73.67 62.56,73.67 63.83,72.4 63.83,68.59 62.56,67.32 39.7,67.32 38.43,66.05 R42.1
  Bottom 0.406: R42.1 38.43,49.54 37.16,48.27 IC7_AND.1
HOURS_5
  Bottom 0.406: IC5_HOURS_UNITS.1 35.89,69.86 34.62,68.59 R43.1
HOURS_6  (via drill 0.6)
  Top 0.406: v53.67,64.78 54.94,63.51 67.64,63.51 68.91,62.24 R44.1
  Bottom 0.406: IC5_HOURS_UNITS.5 v53.67,64.78
HOURS_7  (via drill 0.6)
  Top 0.406: v56.21,57.16 57.48,55.89 63.83,55.89 65.1,54.62 R45.1
  Bottom 0.406: IC5_HOURS_UNITS.6 v56.21,57.16
HOURS_8
  Bottom 0.406: IC5_HOURS_UNITS.9 65.1,77.48 66.37,76.21 66.37,58.43 65.1,57.16 62.56,57.16 61.29,55.89 R46.1
HOURS_9
  Bottom 0.406: IC5_HOURS_UNITS.11 56.21,74.94 57.48,73.67 63.83,73.67 65.1,72.4 65.1,59.7 63.83,58.43 61.29,58.43 57.48,54.62 R47.1
INC_HOURS
  Bottom 0.406: C11.1 R59.1 D11.C | D14.A 54.94,90.18 D11.C | D8.A 57.48,90.18 D11.C
INC_HOURS_TENS
  Bottom 0.406: IC6_HOURS_TENS.14 19.38,85.1 20.65,86.37 52.4,86.37 53.67,85.1 IC5_HOURS_UNITS.12
INC_MINUTES
  Bottom 0.406: D10.C R58.1 C10.1 | D12.A 115.9,90.18 D10.C | D10.C 118.44,90.18 D7.A
INC_MINUTES_TENS
  Bottom 0.406: IC4_MINUTES_TENS.14 79.07,85.1 80.34,86.37 113.36,86.37 114.63,85.1 IC3_MINUTES_UNITS.12
INC_SECONDS_TENS
  Bottom 0.406: IC2_SECONDS_TENS.14 140.03,85.1 141.3,86.37 174.32,86.37 175.59,85.1 IC1_SECONDS_UNITS.12
MASTER_RESET
  Bottom 0.406: D5.A 14.3,95.26 15.57,96.53 42.24,96.53 43.51,95.26 | D6.A 43.51,95.26 | 43.51,95.26 44.78,96.53 72.72,96.53 73.99,95.26 73.99,90.22 D1.A 74.02,95.29 75.26,96.53 103.2,96.53 104.47,95.26 | D4.A 104.47,95.26 | 104.47,95.26 105.74,96.53 133.68,96.53 134.95,95.26 | 134.95,95.26 D2.A | 134.95,95.26 136.22,96.53 164.16,96.53 165.43,95.26 D3.A 165.33,90.18 161.62,90.18 160.11,91.69 S1_RESET.3
MIN_0  (via drill 0.6)
  Top 0.406: v109.55,63.51 110.82,62.24 113.36,62.24 v114.63,60.97
  Bottom 0.406: IC3_MINUTES_UNITS.3 v109.55,63.51 | v114.63,60.97 R30.1
MIN_1  (via drill 0.6)
  Top 0.406: v107.01,57.16 108.28,55.89 109.55,55.89 110.82,54.62 R21.1
  Bottom 0.406: IC3_MINUTES_UNITS.2 v107.01,57.16
MIN_2
  Bottom 0.406: IC3_MINUTES_UNITS.4 112.09,57.16 110.82,55.89 108.28,55.89 107.01,54.62 R22.1
MIN_3  (via drill 0.6)
  Top 0.406: v119.71,60.97 118.44,59.7 104.47,59.7 103.2,58.43 R23.1
  Bottom 0.406: IC3_MINUTES_UNITS.7 v119.71,60.97
MIN_4
  Top 0.406: IC3_MINUTES_UNITS.10 119.71,74.94 120.98,73.67 123.52,73.67 124.79,72.4 124.79,68.59 123.52,67.32 100.66,67.32 99.39,66.05 R24.1
MIN_5
  Bottom 0.406: IC3_MINUTES_UNITS.1 96.85,69.86 95.58,68.59 R25.1
MIN_6  (via drill 0.6)
  Top 0.406: v114.63,64.78 115.9,63.51 128.6,63.51 129.87,62.24 R26.1
  Bottom 0.406: IC3_MINUTES_UNITS.5 v114.63,64.78
MIN_7  (via drill 0.6)
  Top 0.406: v117.17,57.16 118.44,55.89 124.79,55.89 126.06,54.62 R27.1
  Bottom 0.406: IC3_MINUTES_UNITS.6 v117.17,57.16
MIN_8
  Bottom 0.406: IC3_MINUTES_UNITS.9 126.06,77.48 127.33,76.21 127.33,58.43 126.06,57.16 123.52,57.16 122.25,55.89 R28.1
MIN_9
  Bottom 0.406: IC3_MINUTES_UNITS.11 117.17,74.94 118.44,73.67 124.79,73.67 126.06,72.4 126.06,59.7 124.79,58.43 122.25,58.43 118.44,54.62 R29.1
N$1
  Bottom 0.406: R6.2 160.43,43.11 T4.2
N$2
  Bottom 0.406: R7.2 156.62,43.11 T5.2
N$3
  Bottom 0.406: R8.2 190.91,43.11 T6.2
N$4
  Bottom 0.406: R9.2 187.1,43.11 T7.2
N$5
  Bottom 0.406: R10.2 183.29,43.11 T8.2
N$6
  Bottom 0.406: R11.2 179.48,43.11 T9.2
N$7
  Bottom 0.406: R12.2 175.67,43.11 T0.2
N$8
  Top 0.813: R1.1 SECONDS_UNITS.A
N$9
  Top 0.813: R2.1 SECONDS_TENS.A
N$10
  Bottom 0.406: R13.2 149,43.11 T11.2
N$11
  Bottom 0.406: R14.2 145.19,43.11 T12.2
N$12
  Bottom 0.406: R15.2 141.38,43.11 T13.2
N$13
  Bottom 0.406: R16.2 137.57,43.11 T14.2
N$14
  Bottom 0.406: R17.2 133.76,43.11 T15.2
N$15
  Bottom 0.406: R18.2 152.81,43.11 T10.2
N$16
  Bottom 0.406: R3.2 171.86,43.11 T1.2
N$17
  Bottom 0.406: R4.2 168.05,43.11 T2.2
N$18
  Bottom 0.406: R5.2 164.24,43.11 T3.2
N$19
  Bottom 0.406: SECONDS_TENS.1 137.48,19.05 138.76,20.33 145.11,20.33 146.38,21.6 146.38,29.22 147.65,30.49 147.65,36.31 T11.3
N$20
  Bottom 0.406: SECONDS_TENS.2 136.43,12.5 134.95,13.98 134.95,22.34 T12.3
N$21
  Bottom 0.406: SECONDS_TENS.3 135.88,9.24 133.68,11.44 133.68,22.87 140.03,29.22 140.03,36.31 T13.3
N$22
  Bottom 0.406: SECONDS_TENS.4 137.94,6.81 137.49,6.36 134.95,6.36 132.41,8.9 132.41,24.14 136.22,27.95 136.22,31.23 T14.3
N$23
  Bottom 0.406: SECONDS_TENS.5 140.37,5.43 140.03,5.09 133.68,5.09 131.14,7.63 131.14,25.41 132.41,26.68 132.41,36.31 T15.3
N$24
  Bottom 0.406: SECONDS_TENS.0 147.66,27.44 T10.3
N$25
  Bottom 0.406: R42.2 38.51,43.11 T35.2
N$26
  Bottom 0.406: SECONDS_UNITS.1 159.07,19.05 160.35,20.33 169.24,20.33 170.51,21.6 170.51,36.31 T1.3
N$27
  Bottom 0.406: SECONDS_UNITS.2 158.02,12.5 156.54,13.98 156.54,21.07 T2.3
N$28
  Bottom 0.406: SECONDS_UNITS.3 158.16,9.24 157.81,8.9 155.27,11.44 155.27,21.6 162.89,29.22 162.89,36.31 T3.3
N$29
  Bottom 0.406: SECONDS_UNITS.4 159.53,6.81 159.08,6.36 156.54,6.36 154,8.9 154,22.87 159.08,27.95 159.08,31.23 T4.3
N$30
  Bottom 0.406: SECONDS_UNITS.5 161.96,5.43 161.62,5.09 155.27,5.09 152.73,7.63 152.73,24.14 155.27,26.68 155.27,36.31 T5.3
N$31
  Bottom 0.406: T6.3 189.56,31.23 189.56,21.6 173.05,5.09 166.7,5.09 166.36,5.43 SECONDS_UNITS.6
N$32
  Bottom 0.406: T0.3 175.22,17.42 173.05,15.25 169.55,15.25 SECONDS_UNITS.0
N$33
  Bottom 0.406: T9.3 179.03,36.47 178.13,35.57 178.13,17.79 173.05,12.71 170.83,12.71 SECONDS_UNITS.9
N$34
  Bottom 0.406: SECONDS_UNITS.8 172.12,9.24 181.94,19.06 181.94,31.23 T8.3
N$35
  Bottom 0.406: R24.2 99.47,43.11 T19.2
N$36
  Bottom 0.406: R25.2 95.66,43.11 T20.2
N$37
  Bottom 0.406: R26.2 129.95,43.11 T21.2
N$38
  Bottom 0.406: R27.2 126.14,43.11 T22.2
N$39
  Bottom 0.406: R28.2 122.33,43.11 T23.2
N$40
  Bottom 0.406: R29.2 118.52,43.11 T24.2
N$41
  Bottom 0.406: R30.2 114.71,43.11 T25.2
N$42
  Top 0.813: R19.1 MINUTES_UNITS.A
N$43
  Top 0.813: R20.1 MINUTES_TENS.A
N$44
  Bottom 0.406: R31.2 88.04,43.11 T27.2
N$45
  Bottom 0.406: R32.2 84.23,43.11 T28.2
N$46
  Bottom 0.406: R33.2 80.42,43.11 T29.2
N$47
  Bottom 0.406: R34.2 76.61,43.11 T30.2
N$48
  Bottom 0.406: R35.2 72.8,43.11 T31.2
N$49
  Bottom 0.406: R36.2 91.85,43.11 T26.2
N$50
  Bottom 0.406: R21.2 110.9,43.11 T16.2
N$51
  Bottom 0.406: R22.2 107.09,43.11 T17.2
N$52
  Bottom 0.406: R23.2 103.28,43.11 T18.2
N$53
  Bottom 0.406: T27.3 87.06,37.21 86.69,36.84 86.69,31.76 85.42,30.49 MINUTES_TENS.1
N$54
  Bottom 0.406: T28.3 | T28.3 82.88,31.76 82.88,13.98 84.36,12.5 MINUTES_TENS.2
N$55
  Bottom 0.406: MINUTES_TENS.3 83.8,9.24 81.61,11.44 81.61,29.22 80.34,30.49 80.34,36.84 T29.3
N$56
  Bottom 0.406: MINUTES_TENS.4 85.87,6.81 85.42,6.36 82.88,6.36 80.34,8.9 80.34,27.95 76.53,31.76 | 76.53,31.76 | 76.53,31.76 T30.3
N$57
  Bottom 0.406: MINUTES_TENS.5 88.3,5.43 87.96,5.09 81.61,5.09 79.07,7.63 79.07,25.41 72.72,31.76 72.72,36.84 | 72.72,36.84 | 72.72,36.84 T31.3
N$58
  Bottom 0.406: T26.3 | T26.3 95.58,27.95 MINUTES_TENS.0
N$59
  Bottom 0.406: MINUTES_UNITS.1 107,19.05 109.55,21.6 109.55,36.84 109.92,37.21 T16.3
N$60
  Bottom 0.406: T17.3 | T17.3 107.01,31.76 107.01,21.6 104.47,19.06 104.47,13.66 MINUTES_UNITS.2
N$61
  Bottom 0.406: MINUTES_UNITS.3 106.3,9.61 103.2,12.71 103.2,36.84 | 103.2,36.84 | 103.2,36.84 T18.3
N$62
  Bottom 0.406: MINUTES_UNITS.4 107.46,6.81 107.01,6.36 105.74,6.36 101.93,10.17 101.93,29.22 | 101.93,29.22 | 101.93,29.22 T19.3
N$63
  Bottom 0.406: MINUTES_UNITS.5 109.89,5.43 109.55,5.09 104.47,5.09 100.66,8.9 100.66,26.68 95.58,31.76 95.58,36.84 T20.3
N$64
  Bottom 0.406: T21.3 129.13,31.76 128.6,31.76 123.52,26.68 123.52,8.9 119.71,5.09 114.63,5.09 114.29,5.43 MINUTES_UNITS.6
N$65
  Bottom 0.406: MINUTES_UNITS.0 117.18,15.26 118.44,16.52 118.44,26.68 114.63,30.49 114.63,31.76 T25.3
N$66
  Bottom 0.406: MINUTES_UNITS.9 118.23,12.5 119.71,13.98 119.71,27.95 118.44,29.22 118.44,36.84 T24.3
N$67
  Bottom 0.406: MINUTES_UNITS.8 117.88,9.61 120.98,12.71 120.98,31.23 T23.3
N$68
  Bottom 0.406: R43.2 34.7,43.11 T36.2
N$69
  Bottom 0.406: R44.2 68.99,43.11 T37.2
N$70
  Bottom 0.406: R45.2 65.18,43.11 T38.2
N$71
  Bottom 0.406: R46.2 61.37,43.11 T39.2
N$72
  Bottom 0.406: R47.2 57.56,43.11 T40.2
N$73
  Bottom 0.406: R48.2 53.75,43.11 T41.2
N$74
  Top 0.813: R37.1 HOURS_UNITS.A
N$75
  Top 0.813: R38.1 HOURS_TENS.A
N$76
  Bottom 0.406: R49.2 27.08,43.11 T43.2
N$77
  Bottom 0.406: R50.2 23.27,43.11 T44.2
N$78
  Bottom 0.406: HOURS_TENS.0 43.52,19.05 42.24,20.33 32.08,20.33 30.81,21.6 30.81,31.76 T42.3
N$79
  Bottom 0.406: SECONDS_UNITS.7 172.23,6.81 185.75,20.33 185.75,36.31 T7.3
N$80
  Bottom 0.406: IC2_SECONDS_TENS.15 R55.1 D2.C D7.C
N$81
  Bottom 0.406: R54.2 30.89,43.11 T42.2
N$82
  Bottom 0.406: R39.2 49.94,43.11 T32.2
N$83
  Bottom 0.406: R40.2 46.13,43.11 T33.2
N$84
  Bottom 0.406: R41.2 42.32,43.11 T34.2
N$85
  Bottom 0.406: HOURS_TENS.1 33.34,15.26 27,21.6 27,36.84 T43.3
N$86
  Bottom 0.406: HOURS_TENS.2 32.28,12.5 23.19,21.6 23.19,31.76 T44.3
N$87
  Bottom 0.406: MINUTES_UNITS.7 118.89,6.81 122.25,10.17 122.25,27.95 124.79,30.49 124.79,36.31 T22.3
N$88
  Bottom 0.406: HOURS_UNITS.7 66.82,6.81 70.18,10.17 70.18,24.14 65.1,29.22 65.1,36.84 T38.3
N$89
  Bottom 0.406: D3.C 167.87,82.66 R51.1 IC1_SECONDS_UNITS.15
N$90
  Top 0.406: IC2_SECONDS_TENS.5 145.11,72.4 143.84,73.67 128.6,73.67 127.33,74.94 127.33,81.29 126.06,82.56 C10.2
N$91
  Bottom 0.406: HOURS_UNITS.1 54.93,25.42 49.86,30.49 49.86,36.84 T32.3
N$92
  Bottom 0.406: HOURS_UNITS.2 53.88,12.5 52.4,13.98 52.4,25.41 | 52.4,25.41 | 52.4,25.41 T33.3
N$93
  Bottom 0.406: HOURS_UNITS.3 53.32,9.24 51.13,11.44 51.13,22.87 42.24,31.76 42.24,36.84 | 42.24,36.84 | 42.24,36.84 T34.3
N$94
  Bottom 0.406: HOURS_UNITS.4 51.95,6.81 49.86,8.9 49.86,20.33 38.43,31.76 | 38.43,31.76 | 38.43,31.76 T35.3
N$95
  Bottom 0.406: T36.3 34.62,36.84 34.62,31.76 48.59,17.79 48.59,7.63 51.13,5.09 57.48,5.09 57.82,5.43 HOURS_UNITS.5
N$96
  Bottom 0.406: T37.3 68.91,31.76 68.91,27.95 71.45,25.41 71.45,8.9 67.64,5.09 62.56,5.09 62.22,5.43 HOURS_UNITS.6
N$97
  Bottom 0.406: HOURS_UNITS.0 65.11,19.05 63.83,20.33 57.48,20.33 56.21,21.6 56.21,29.22 T41.3
N$98
  Bottom 0.406: HOURS_UNITS.9 67.12,12.19 67.64,12.71 67.64,21.6 57.48,31.76 57.48,36.84 T40.3
N$99
  Bottom 0.406: HOURS_UNITS.8 66.72,9.24 68.91,11.44 68.91,22.87 61.29,30.49 61.29,31.76 T39.3
N$100
  Bottom 0.406: D8.C 74,82.56 D1.C 76.52,82.57 R56.1 IC4_MINUTES_TENS.15
N$101
  Top 0.406: C11.2 65.1,82.56 66.37,81.29 66.37,74.94 67.64,73.67 82.88,73.67 84.15,72.4 IC4_MINUTES_TENS.5
N$102
  Bottom 0.406: D4.C 107,82.55 R52.1 IC3_MINUTES_UNITS.15
N$103
  Bottom 0.406: 109.55,80.02 D13.C | D13.C IC3_MINUTES_UNITS.14 | D13.C D12.C
N$104
  Bottom 0.406: D5.C 14.19,82.45 D9.C R57.1 IC6_HOURS_TENS.15
N$105
  Bottom 0.406: IC5_HOURS_UNITS.14 D15.C D14.C
N$107
  Top 0.813: R61.2 LMP2.P$1
N$108
  Top 0.813: R60.2 LMP1.P$1
N$109
  Bottom 0.406: IC5_HOURS_UNITS.15 R53.2 45.99,82.62 D6.C 43.45,82.56 D16.C
RESET_HOURS
  Bottom 0.406: IC7_AND.3 15.57,53.35 14.3,54.62 14.3,64.78 13.03,66.05 7.95,66.05 6.68,67.32 6.68,88.91 7.95,90.18 D9.A 11.76,87.64 13.03,86.37 16.84,86.37 20.65,90.18 D16.A
SEC_0  (via drill 0.6)
  Top 0.406: v170.51,63.51 171.78,62.24 174.32,62.24 v175.59,60.97
  Bottom 0.406: IC1_SECONDS_UNITS.3 v170.51,63.51 | v175.59,60.97 R12.1
SEC_1  (via drill 0.6)
  Top 0.406: v167.97,57.16 169.24,55.89 170.51,55.89 171.78,54.62 R3.1
  Bottom 0.406: IC1_SECONDS_UNITS.2 v167.97,57.16
SEC_2
  Bottom 0.406: R4.1 167.97,54.62 169.24,55.89 171.78,55.89 173.05,57.16 IC1_SECONDS_UNITS.4
SEC_3  (via drill 0.6)
  Top 0.406: v180.67,60.97 179.4,59.7 165.43,59.7 164.16,58.43 R5.1
  Bottom 0.406: IC1_SECONDS_UNITS.7 v180.67,60.97
SEC_4
  Top 0.406: IC1_SECONDS_UNITS.10 180.67,74.94 181.94,73.67 184.48,73.67 185.75,72.4 185.75,68.59 184.48,67.32 161.62,67.32 160.35,66.05 R6.1
SEC_5
  Bottom 0.406: IC1_SECONDS_UNITS.1 157.81,69.86 156.54,68.59 R7.1
SEC_6  (via drill 0.6)
  Top 0.406: v175.59,64.78 176.86,63.51 189.56,63.51 190.83,62.24 R8.1
  Bottom 0.406: IC1_SECONDS_UNITS.5 v175.59,64.78
SEC_7  (via drill 0.6)
  Top 0.406: R9.1 187.02,54.62 185.75,55.89 179.4,55.89 v178.13,57.16
  Bottom 0.406: v178.13,57.16 IC1_SECONDS_UNITS.6
SEC_8
  Bottom 0.406: IC1_SECONDS_UNITS.9 187.02,77.48 188.29,76.21 188.29,58.43 187.02,57.16 184.48,57.16 183.21,55.89 R10.1
SEC_9
  Bottom 0.406: IC1_SECONDS_UNITS.11 178.13,74.94 179.4,73.67 185.75,73.67 187.02,72.4 187.02,59.7 185.75,58.43 183.21,58.43 179.4,54.62 R11.1
THOURS_0
  Top 0.406: IC6_HOURS_TENS.3 19.38,68.59 21.92,66.05 29.54,66.05 30.81,64.78 R54.1
THOURS_1
  Top 0.406: R49.1 27,62.24 25.73,63.51 20.65,63.51 16.84,67.32 IC6_HOURS_TENS.2
THOURS_2
  Bottom 0.406: IC6_HOURS_TENS.4 21.92,68.59 23.19,67.32 R50.1 23.19,50.81 IC7_AND.2
TIME_REFERENCE
  Top 0.406: CON_TIME_REF.P$1 171.78,83.83 170.51,82.56 IC1_SECONDS_UNITS.14
TMIN_0
  Top 0.406: IC4_MINUTES_TENS.3 79.07,67.32 80.34,66.05 90.5,66.05 91.77,64.78 R36.1
TMIN_1
  Top 0.406: IC4_MINUTES_TENS.2 76.53,64.78 77.8,63.51 86.69,63.51 87.96,62.24 R31.1
TMIN_2  (via drill 0.6)
  Top 0.406: v84.15,58.43 R32.1
  Bottom 0.406: IC4_MINUTES_TENS.4 81.61,60.97 v84.15,58.43
TMIN_3  (via drill 0.6)
  Top 0.406: R33.1 80.34,59.7 81.61,60.97 v85.42,60.97
  Bottom 0.406: v85.42,60.97 87.96,60.97 89.23,62.24 IC4_MINUTES_TENS.7
TMIN_4
  Bottom 0.406: IC4_MINUTES_TENS.10 89.23,74.94 90.5,73.67 93.04,73.67 94.31,72.4 94.31,57.16 93.04,55.89 77.8,55.89 76.53,54.62 R34.1
TMIN_5
  Bottom 0.406: IC4_MINUTES_TENS.1 72.72,68.59 R35.1
TSEC_0
  Top 0.406: IC2_SECONDS_TENS.3 140.03,67.32 141.3,66.05 151.46,66.05 152.73,64.78 R18.1
TSEC_1
  Top 0.406: IC2_SECONDS_TENS.2 137.49,64.78 138.76,63.51 147.65,63.51 148.92,62.24 R13.1
TSEC_2  (via drill 0.6)
  Top 0.406: v145.11,58.43 R14.1
  Bottom 0.406: IC2_SECONDS_TENS.4 142.57,60.97 v145.11,58.43
TSEC_3  (via drill 0.6)
  Top 0.406: v146.38,60.97 142.57,60.97 141.3,59.7 R15.1
  Bottom 0.406: IC2_SECONDS_TENS.7 150.19,62.24 148.92,60.97 v146.38,60.97
TSEC_4
  Bottom 0.406: IC2_SECONDS_TENS.10 150.19,74.94 151.46,73.67 154,73.67 155.27,72.4 155.27,57.16 154,55.89 138.76,55.89 137.49,54.62 R16.1
TSEC_5
  Bottom 0.406: IC2_SECONDS_TENS.1 133.68,68.59 R17.1
VCC
  Top 0.406: IC3_MINUTES_UNITS.16 C3.1 99.39,97.8 | IC2_SECONDS_TENS.16 C2.1 129.87,93.99 | IC1_SECONDS_UNITS.16 C1.1 160.35,87.64 155.59,92.4 S1_RESET.1 155.59,97.48 155.27,97.8 | IC4_MINUTES_TENS.16 C4.1 68.91,93.99 | IC5_HOURS_UNITS.16 C5.1 38.43,97.8 | 38.43,97.8 10.49,97.8 9.22,96.53 C6.1 | 38.43,97.8 48.59,97.8 | 48.59,97.8 68.91,97.8 | 68.91,97.8 99.39,97.8 | 99.39,97.8 109.55,97.8 | 109.55,97.8 129.87,97.8 | 129.87,93.99 129.87,97.8 | 68.91,93.99 68.91,97.8 | C7.1 109.55,97.8 | C8.1 48.59,97.8 | S2_MINUTE.3 122.68,93.99 129.87,93.99 | S3_HOUR.3 61.72,93.99 68.91,93.99 | 129.87,97.8 155.27,97.8 | 155.27,97.8 171.78,97.8 CON_LOGIC_POWER.P$1 | C9.1 IC7_AND.14 7.95,48.27 6.68,49.54 6.68,74.94 C6.1 | IC6_HOURS_TENS.16 C6.1
VHIGH
  Top 0.813: R1.2 R2.2 R61.1 R19.2 R20.2 R60.1 R37.2 R38.2 18.11,25.41 13.03,30.49 CON_HIGH_VOLTAGE.P$1

### Text on the board
Top: GND | HIGH
Bottom: GND | VDD | GND | TIME